# EAGLE design boat6 (EAGLE 7.6.0)
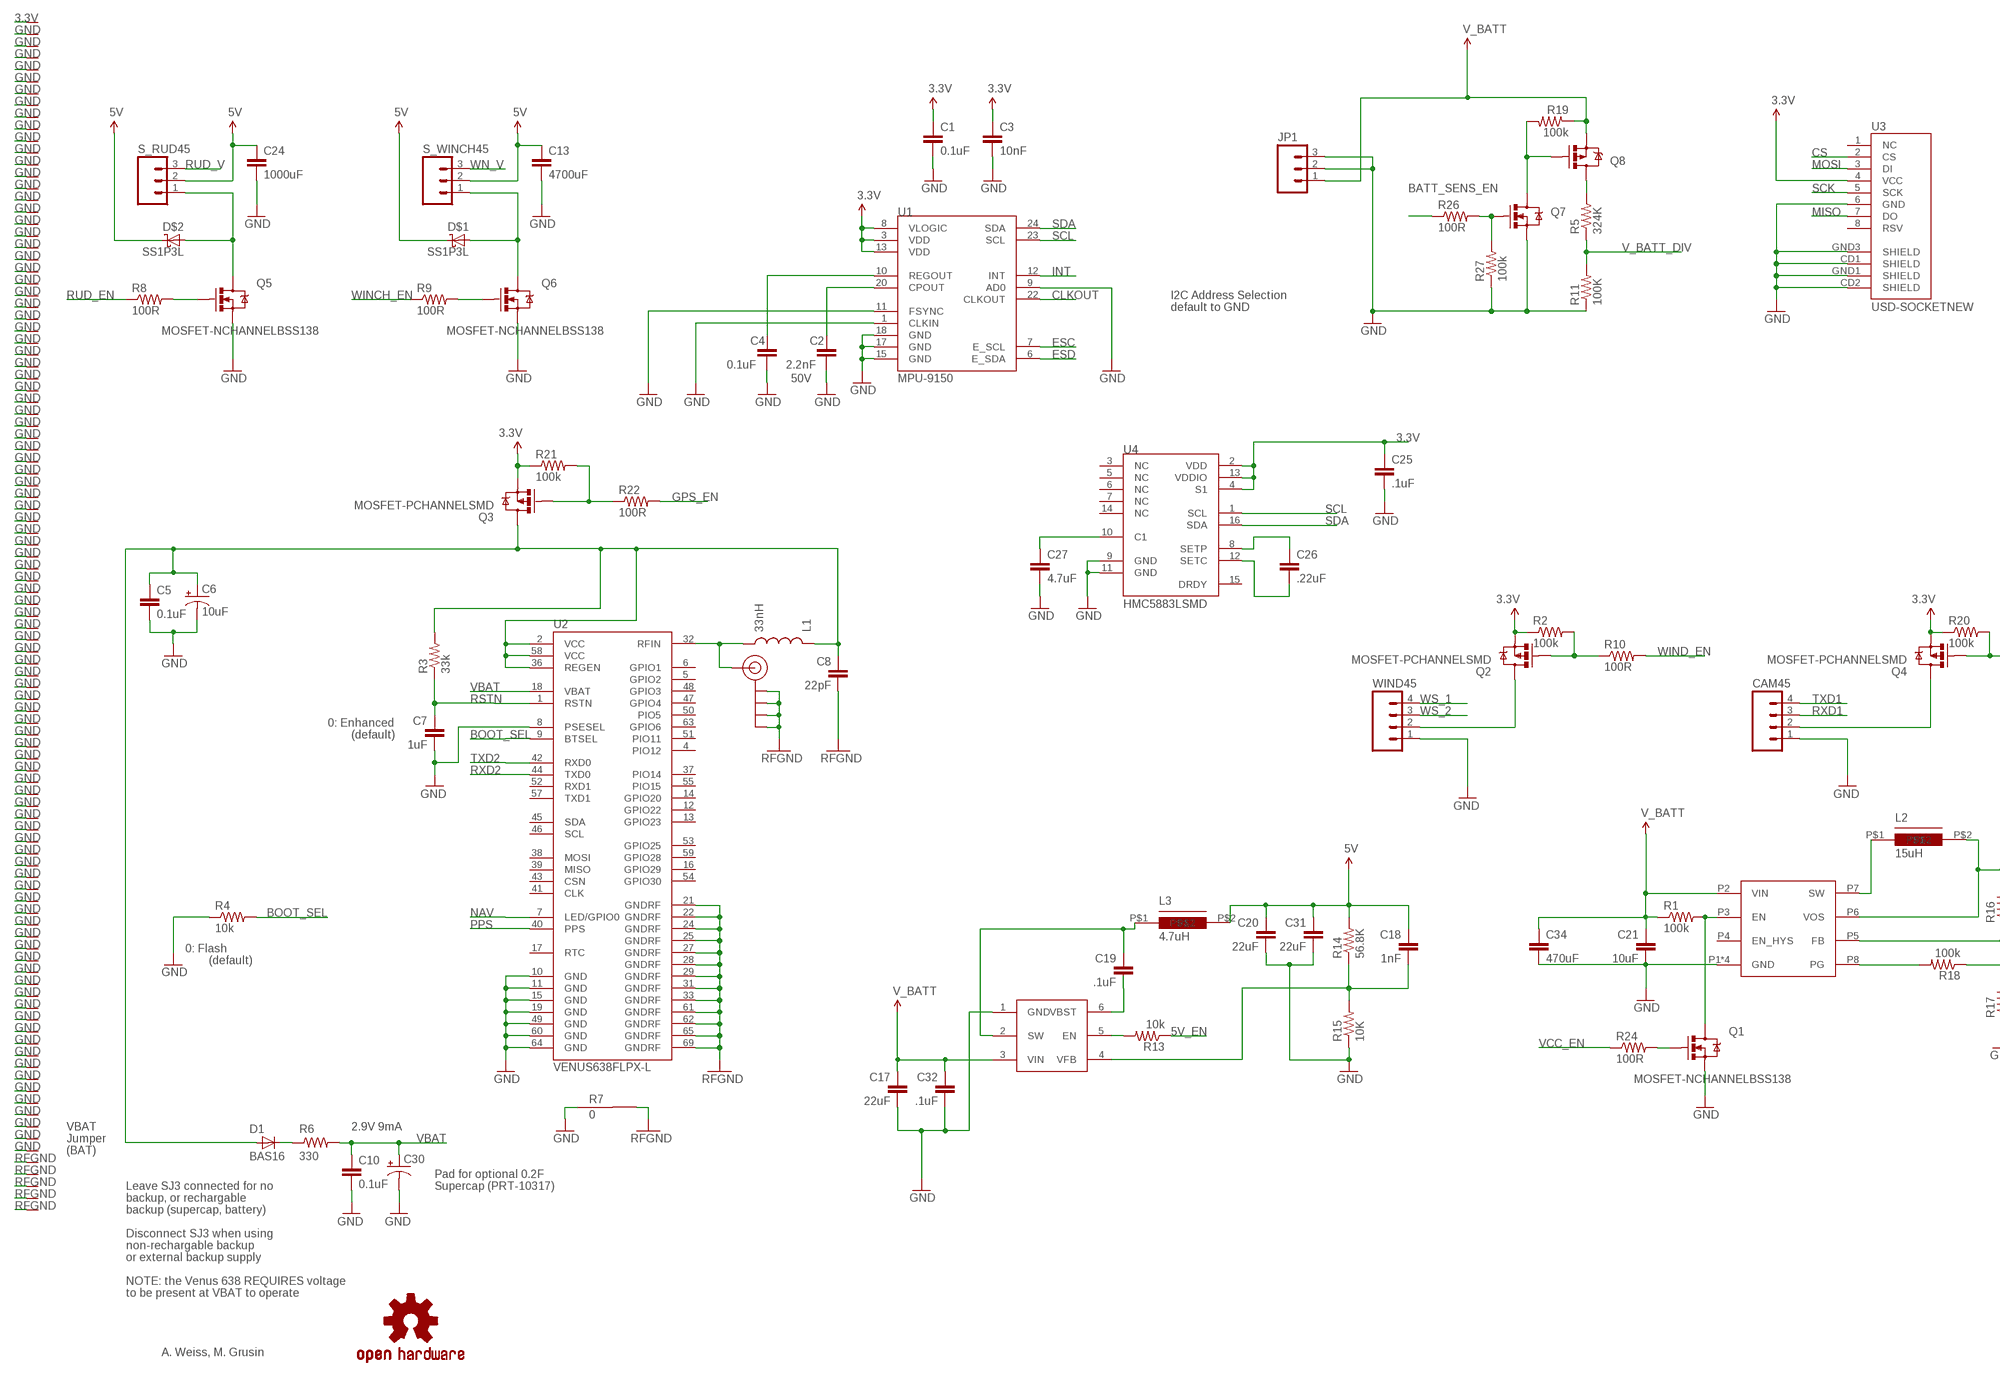
[diagram p0: schematic, sheet 1, part 1 of 2]
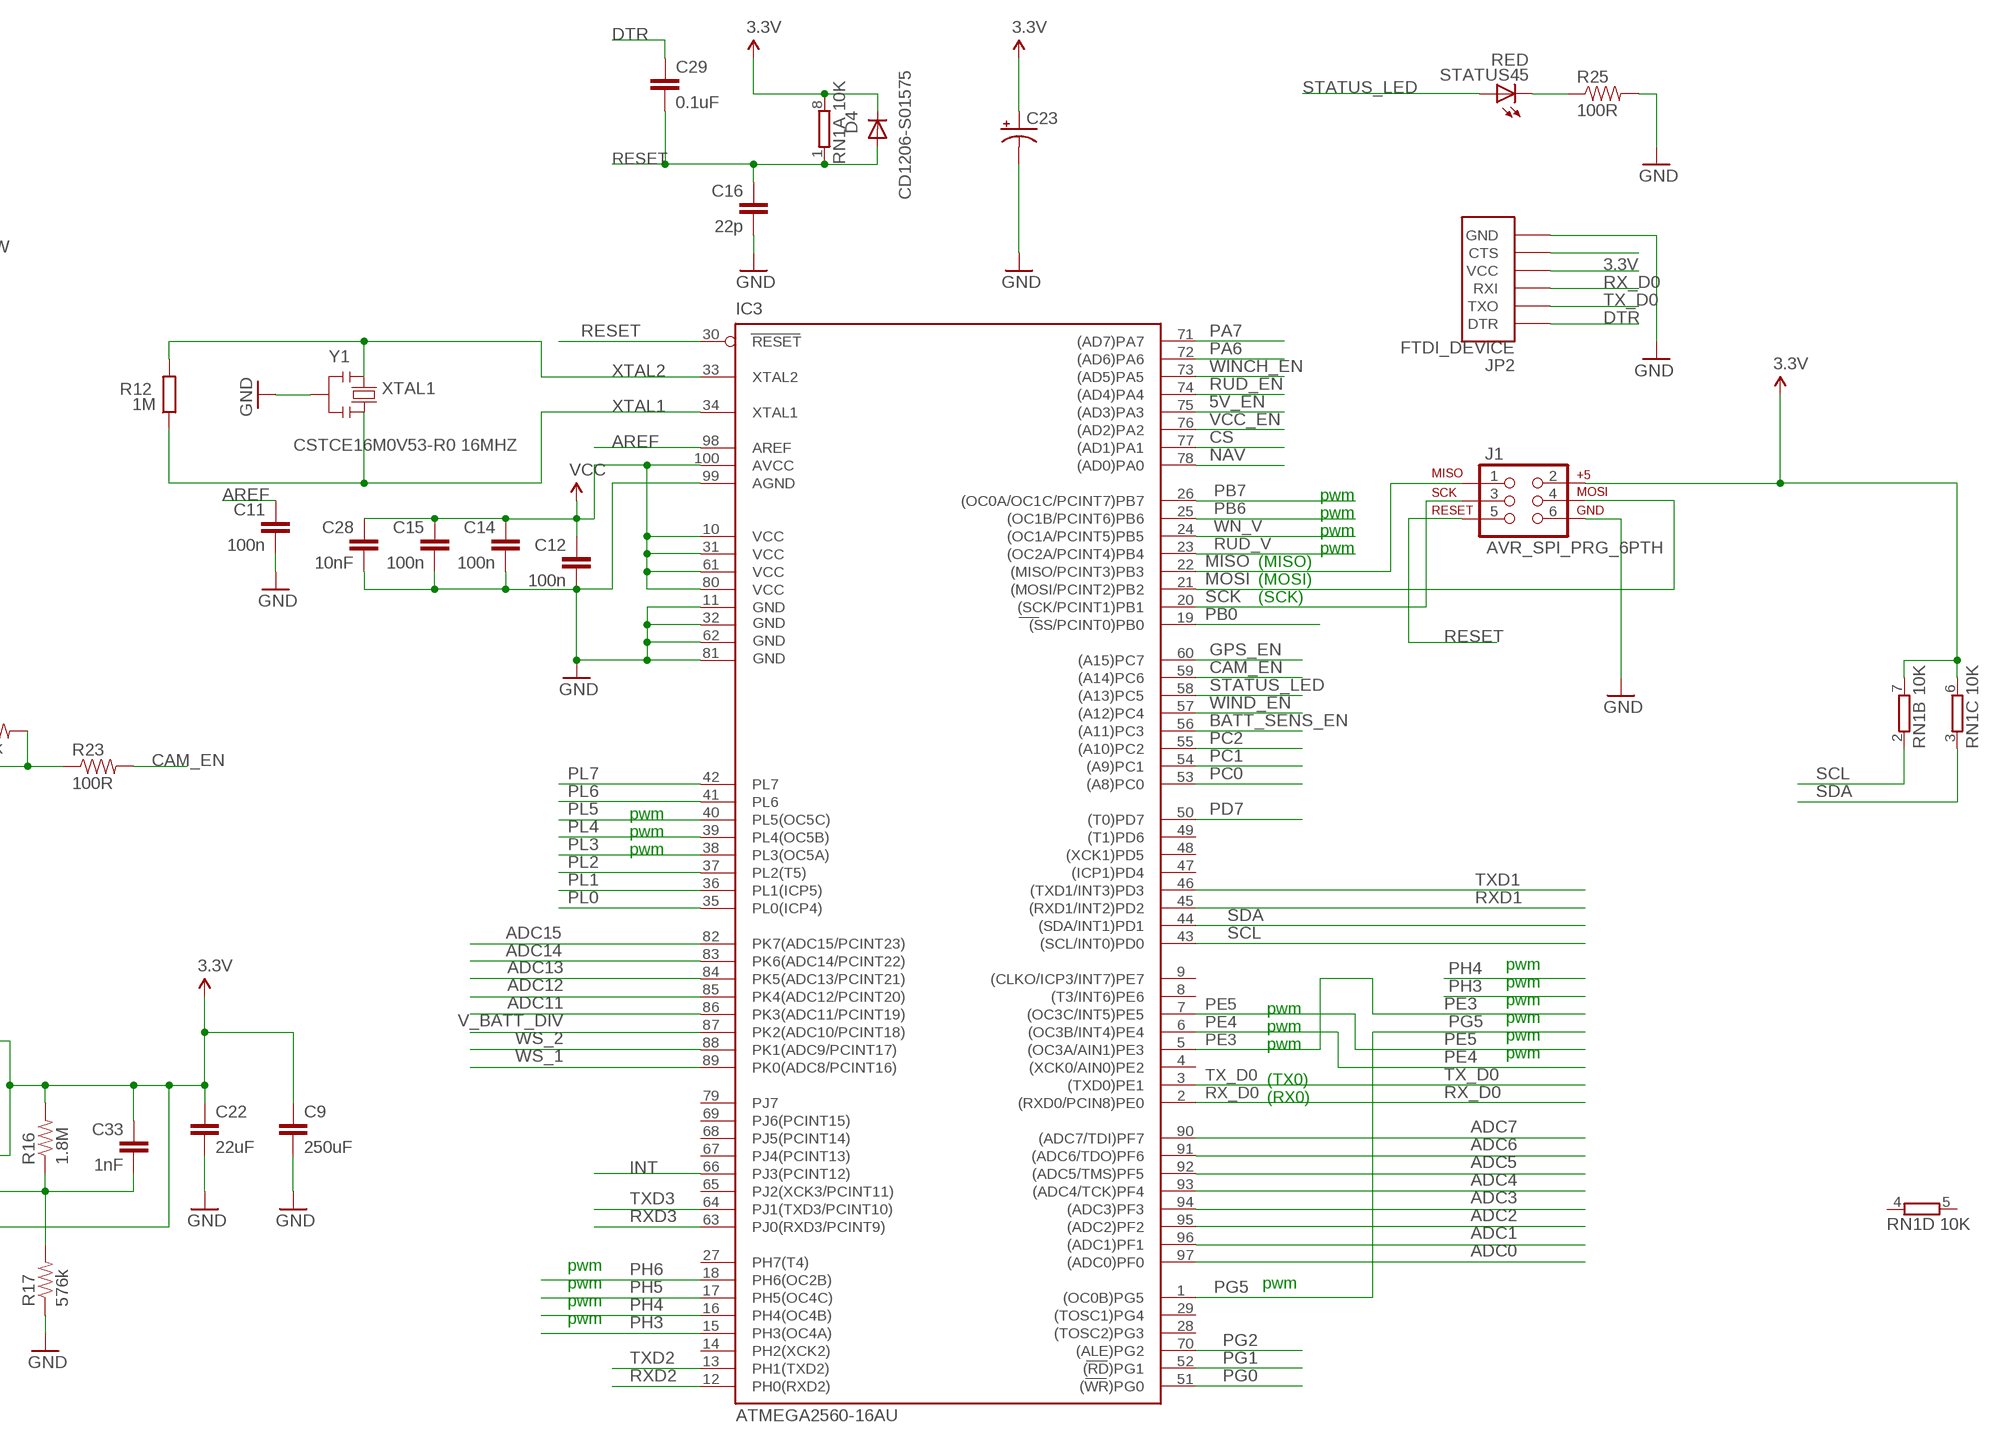
[diagram p1: schematic, sheet 1, part 2 of 2]

## Parts
C1  0.1uF  CAP0603-CAP  [0603-CAP]
C2  2.2nF  CAP0603-CAP  [0603-CAP]
C3  10nF  CAP0603-CAP  [0603-CAP]
C4  0.1uF  CAP0603-CAP  [0603-CAP]
C5  0.1uF  CAP0603-CAP  [0603-CAP]
C6  10uF  CAP_POL1206  [EIA3216]
C7  1uF  CAP0603-CAP  [0603-CAP]
C8  22pF  CAP0603-CAP  [0603-CAP]
C9  250uF  CAPPTH1  [CAP-PTH-5MM]
C10  0.1uF  CAP0603-CAP  [0603-CAP]
C11  100n  C-EU0603-RND  [C0603-ROUND]
C12  100n  C-EU0603-RND  [C0603-ROUND]
C13  4700uF  CAPPTH1  [CAP-PTH-5MM]
C14  100n  C-EU0603-RND  [C0603-ROUND]
C15  100n  C-EU0603-RND  [C0603-ROUND]
C16  22p  C-EU0603-RND  [C0603-ROUND]
C17  22uF  CAP1206  [1206]
C18  1nF  CAP0805  [0805]
C19  .1uF  CAP0805  [0805]
C20  22uF  CAP1206  [1206]
C21  10uF  CAP0805  [0805]
C22  22uF  CAP0805  [0805]
C23  CAP_POL  [DSK-621]
C24  1000uF  CAPPTH1  [CAP-PTH-5MM]
C25  .1uF  CAP0603-CAP  [0603-CAP]
C26  .22uF  CAP0603-CAP  [0603-CAP]
C27  4.7uF  CAP0603-CAP  [0603-CAP]
C28  10nF  CAP0603-CAP  [0603-CAP]
C29  0.1uF  CAP0402-CAP  [0402-CAP]
C30  CAP_POL  [DSK-621]
C31  22uF  CAP1206  [1206]
C32  .1uF  CAP0805  [0805]
C33  1nF  CAP0402-CAP  [0402-CAP]
C34  470uF  CAPPTH1  [CAP-PTH-5MM]
CAM45  M04PTH  [1X04]
D1  BAS16  DIODESOD  [SOD-323]
D4  CD1206-S01575  DIODE-MINIMELF  [MINIMELF]
D$1  SS1P3L  [MICROSMP]
D$2  SS1P3L  [MICROSMP]
IC3  ATMEGA2560-16AU  ATMEGA25602560-16AU  [TQFP100]
J1  AVR_SPI_PRG_6PTH  [2X3]
JP1  M03SCREW  [SCREWTERMINAL-3.5MM-3]
JP2  FTDI_DEVICE  [FTDI_DEVICE_SIDE]
JP5  SMA_EDGE  [SMA-EDGE]
L1  33nH  INDUCTOR0603  [0603]
L2  15uH  VLCF4020  [VLCF4020]
L3  4.7uH  SLF60287055  [SLF7055]
Q1  MOSFET-NCHANNELBSS138  [SOT23]
Q2  MOSFET-PCHANNELSMD  [SOT23-3]
Q3  MOSFET-PCHANNELSMD  [SOT23-3]
Q4  MOSFET-PCHANNELSMD  [SOT23-3]
Q5  MOSFET-NCHANNELBSS138  [SOT23]
Q6  MOSFET-NCHANNELBSS138  [SOT23]
Q7  MOSFET-NCHANNELBSS138  [SOT23]
Q8  MOSFET-PCHANNELSMD  [SOT23-3]
R1  100k  RESISTOR0603  [0603-RES]
R2  100k  RESISTOR0603  [0603-RES]
R3  33k  RESISTOR0603-RES  [0603-RES]
R4  10k  RESISTOR0603-RES  [0603-RES]
R5  324K  RESISTOR0603-RES  [0603-RES]
R6  330  RESISTOR0603-RES  [0603-RES]
R7  0  GND-JUMP  [GND-JUMP]
R8  100R  RESISTOR0603  [0603-RES]
R9  100R  RESISTOR0603  [0603-RES]
R10  100R  RESISTOR0603  [0603-RES]
R11  100K  RESISTOR0603-RES  [0603-RES]
R12  1M  R-EU_R0603  [R0603-ROUND]
R13  10k  RESISTOR0603  [0603-RES]
R14  56.8K  RESISTOR0603  [0603-RES]
R15  10K  RESISTOR0603  [0603-RES]
R16  1.8M  RESISTOR0603  [0603-RES]
R17  576k  RESISTOR0603  [0603-RES]
R18  100k  RESISTOR0603  [0603-RES]
R19  100k  RESISTOR0603  [0603-RES]
R20  100k  RESISTOR0603  [0603-RES]
R21  100k  RESISTOR0603  [0603-RES]
R22  100R  RESISTOR0603  [0603-RES]
R23  100R  RESISTOR0603  [0603-RES]
R24  100R  RESISTOR0603  [0603-RES]
R25  100R  RESISTOR0603  [0603-RES]
R26  100R  RESISTOR0603  [0603-RES]
R27  100k  RESISTOR0603  [0603-RES]
RN1  10K  4R-NCAT16  [CAT16]
S_RUD45  M03PTH  [1X03]
S_WINCH45  M03PTH  [1X03]
STATUS45  RED  LED-RED0603  [LED-0603]
U1  MPU-9150  MPU-9150QFN-24-NP  [QFN-24-NP]
U2  VENUS638FLPX-L  [VENUS638FLPX]
U3  USD-SOCKETNEW  [MICRO-SD-SOCKET-PP]
U4  HMC5883LSMD  [16LPCC]
U$1  TPS62125  [S-PWSON-N8]
U$2  TPS56X200  [SOT23-6]
U$4  OSHW-LOGOS  [OSHW-LOGO-S]
VP_0  VPDEV0  [VPAC0]
VP_1  VPDEV1  [VPAC1]
VP_2  VPDEV1  [VPAC1]
VP_3  VPDEV1  [VPAC1]
VP_4  VPDEV0  [VPAC0]
VP_5  VPDEV2  [VPAC2]
VP_6  VPDEV2  [VPAC2]
VP_7  VPDEV2  [VPAC2]
VP_8  VPDEV2  [VPAC2]
VP_9  VPDEV2  [VPAC2]
VP_10  VPDEV2  [VPAC2]
VP_11  VPDEV0  [VPAC0]
VP_12  VPDEV2  [VPAC2]
VP_13  VPDEV2  [VPAC2]
VP_14  VPDEV2  [VPAC2]
VP_15  VPDEV2  [VPAC2]
VP_16  VPDEV0  [VPAC0]
VP_17  VPDEV2  [VPAC2]
VP_18  VPDEV2  [VPAC2]
VP_19  VPDEV2  [VPAC2]
VP_20  VPDEV2  [VPAC2]
VP_21  VPDEV2  [VPAC2]
VP_22  VPDEV2  [VPAC2]
VP_23  VPDEV0  [VPAC0]
VP_24  VPDEV0  [VPAC0]
VP_25  VPDEV0  [VPAC0]
VP_26  VPDEV0  [VPAC0]
VP_27  VPDEV2  [VPAC2]
VP_28  VPDEV0  [VPAC0]
VP_29  VPDEV0  [VPAC0]
VP_30  VPDEV2  [VPAC2]
VP_31  VPDEV2  [VPAC2]
VP_32  VPDEV0  [VPAC0]
VP_33  VPDEV2  [VPAC2]
VP_34  VPDEV2  [VPAC2]
VP_35  VPDEV2  [VPAC2]
VP_36  VPDEV2  [VPAC2]
VP_37  VPDEV2  [VPAC2]
VP_38  VPDEV0  [VPAC0]
VP_39  VPDEV0  [VPAC0]
VP_40  VPDEV0  [VPAC0]
VP_41  VPDEV0  [VPAC0]
VP_42  VPDEV0  [VPAC0]
VP_43  VPDEV0  [VPAC0]
VP_44  VPDEV0  [VPAC0]
VP_45  VPDEV0  [VPAC0]
VP_46  VPDEV2  [VPAC2]
VP_47  VPDEV2  [VPAC2]
VP_48  VPDEV2  [VPAC2]
VP_49  VPDEV2  [VPAC2]
VP_50  VPDEV2  [VPAC2]
VP_51  VPDEV2  [VPAC2]
VP_52  VPDEV2  [VPAC2]
VP_53  VPDEV2  [VPAC2]
VP_54  VPDEV2  [VPAC2]
VP_55  VPDEV2  [VPAC2]
VP_56  VPDEV2  [VPAC2]
VP_57  VPDEV2  [VPAC2]
VP_58  VPDEV2  [VPAC2]
VP_59  VPDEV2  [VPAC2]
VP_60  VPDEV0  [VPAC0]
VP_61  VPDEV0  [VPAC0]
VP_62  VPDEV0  [VPAC0]
VP_63  VPDEV2  [VPAC2]
VP_64  VPDEV2  [VPAC2]
VP_65  VPDEV2  [VPAC2]
VP_66  VPDEV2  [VPAC2]
VP_67  VPDEV2  [VPAC2]
VP_68  VPDEV2  [VPAC2]
VP_69  VPDEV2  [VPAC2]
VP_70  VPDEV0  [VPAC0]
VP_71  VPDEV0  [VPAC0]
VP_72  VPDEV0  [VPAC0]
VP_73  VPDEV0  [VPAC0]
VP_74  VPDEV0  [VPAC0]
VP_75  VPDEV0  [VPAC0]
VP_76  VPDEV2  [VPAC2]
VP_77  VPDEV2  [VPAC2]
VP_78  VPDEV2  [VPAC2]
VP_79  VPDEV0  [VPAC0]
VP_80  VPDEV0  [VPAC0]
VP_81  VPDEV2  [VPAC2]
VP_82  VPDEV2  [VPAC2]
VP_83  VPDEV2  [VPAC2]
VP_84  VPDEV2  [VPAC2]
VP_85  VPDEV2  [VPAC2]
VP_86  VPDEV2  [VPAC2]
VP_87  VPDEV2  [VPAC2]
VP_88  VPDEV2  [VPAC2]
VP_89  VPDEV2  [VPAC2]
VP_90  VPDEV2  [VPAC2]
VP_91  VPDEV2  [VPAC2]
VP_92  VPDEV2  [VPAC2]
VP_93  VPDEV2  [VPAC2]
VP_94  VPDEV2  [VPAC2]
VP_95  VPDEV2  [VPAC2]
VP_96  VPDEV1  [VPAC1]
VP_97  VPDEV1  [VPAC1]
VP_98  VPDEV1  [VPAC1]
VP_99  VPDEV1  [VPAC1]
VP_100  VPDEV1  [VPAC1]
WIND45  M04PTH  [1X04]
Y1  CSTCE16M0V53-R0 16MHZ  RESONATORMU  [RESONATOR]

## Nets
3.3V: C1.1 C3.1 C9.1 C12.1 C14.1 C15.1 C22.1 C23.VCC(+) C25.1 C28.1 C33.1 D4.C IC3.10(VCC) IC3.31(VCC1) IC3.61(VCC2) IC3.80(VCC3) IC3.100(AVCC) J1.2 JP2.P$4(VCC) L2.P$2 Q2.2(S) Q3.2(S) Q4.2(S) R2.1 R16.2 R18.1 R20.1 R21.1 RN1.6 RN1.7 RN1.8 U1.3(VDD) U1.8(VLOGIC) U1.13(VDD) U3.4(VCC) U4.2(VDD) U4.4(S1) U4.13(VDDIO) U$1.P6(VOS) VP_0.VP ; supply symbol labelled VCC
5V: C13.1 C18.1 C20.1 C24.1 C31.1 D$1.C D$2.C L3.P$2 R14.2 S_RUD45.2 S_WINCH45.2
5V_EN: IC3.75((AD3)PA3) R13.1
ADC0: IC3.97((ADC0)PF0)
ADC1: IC3.96((ADC1)PF1)
ADC2: IC3.95((ADC2)PF2)
ADC3: IC3.94((ADC3)PF3)
ADC4: IC3.93((ADC4/TCK)PF4)
ADC5: IC3.92((ADC5/TMS)PF5)
ADC6: IC3.91((ADC6/TDO)PF6)
ADC7: IC3.90((ADC7/TDI)PF7)
ADC11: IC3.86(PK3(ADC11/PCINT19))
ADC12: IC3.85(PK4(ADC12/PCINT20))
ADC13: IC3.84(PK5(ADC13/PCINT21))
ADC14: IC3.83(PK6(ADC14/PCINT22))
ADC15: IC3.82(PK7(ADC15/PCINT23))
ANT: JP5.SIG(SIGNAL) L1.2 U2.32(RFIN)
AREF: C11.1 IC3.98(AREF)
BATT_SENS_EN: IC3.56((A11)PC3) R26.1
BOOT_SEL: R4.2 U2.9(BTSEL)
CAM_EN: IC3.59((A14)PC6) R23.2
CLKOUT: U1.22(CLKOUT)
CS: IC3.77((AD1)PA1) U3.2(CS)
DTR: C29.1 JP2.P$1(DTR)
ESC: U1.7(E_SCL)
ESD: U1.6(E_SDA)
GND: C1.2 C2.2 C3.2 C4.2 C5.2 C6.C(-) C7.2 C9.2 C10.2 C11.2 C12.2 C13.2 C14.2 C15.2 C16.2 C17.2 C20.2 C21.2 C22.2 C23.GND(-) C24.2 C25.2 C27.2 C28.2 C30.GND(-) C31.2 C32.2 C34.2 CAM45.1 IC3.11(GND) IC3.32(GND1) IC3.62(GND2) IC3.81(GND3) IC3.99(AGND) J1.6 JP1.2 JP1.3 JP2.P$6(GND) Q1.2(S) Q5.2(S) Q6.2(S) Q7.2(S) R4.1 R7.1 R11.1 R15.1 R17.1 R25.2 R27.1 U1.1(CLKIN) U1.9(AD0) U1.11(FSYNC) U1.15(GND) U1.17(GND) U1.18(GND) U2.8(PSESEL) U2.10(GND) U2.11(GND) U2.15(GND) U2.19(GND) U2.49(GND) U2.60(GND) U2.64(GND) U3.6(GND) U3.CD1(SHIELD) U3.CD2(SHIELD) U3.GND1(SHIELD) U3.GND3(SHIELD) U4.9(GND) U4.11(GND) U$1.P1(GND) U$1.P_THERM(GND) U$1.P_THERM_VIA1(GND) U$1.P_THERM_VIA(GND) U$2.1(GND) VP_1.VP VP_2.VP VP_3.VP VP_4.VP VP_5.VP VP_6.VP VP_7.VP VP_8.VP VP_9.VP VP_10.VP VP_11.VP VP_12.VP VP_13.VP VP_14.VP VP_15.VP VP_16.VP VP_17.VP VP_18.VP VP_19.VP VP_20.VP VP_21.VP VP_22.VP VP_23.VP VP_24.VP VP_25.VP VP_26.VP VP_27.VP VP_28.VP VP_29.VP VP_30.VP VP_31.VP VP_32.VP VP_33.VP VP_34.VP VP_35.VP VP_36.VP VP_37.VP VP_38.VP VP_39.VP VP_40.VP VP_41.VP VP_42.VP VP_43.VP VP_44.VP VP_45.VP VP_46.VP VP_47.VP VP_48.VP VP_49.VP VP_50.VP VP_51.VP VP_52.VP VP_53.VP VP_54.VP VP_55.VP VP_56.VP VP_57.VP VP_58.VP VP_59.VP VP_60.VP VP_61.VP VP_62.VP VP_63.VP VP_64.VP VP_65.VP VP_66.VP VP_67.VP VP_68.VP VP_69.VP VP_70.VP VP_71.VP VP_72.VP VP_73.VP VP_74.VP VP_75.VP VP_76.VP VP_77.VP VP_78.VP VP_79.VP VP_80.VP VP_81.VP VP_82.VP VP_83.VP VP_84.VP VP_85.VP VP_86.VP VP_87.VP VP_88.VP VP_89.VP VP_90.VP VP_91.VP VP_92.VP VP_93.VP VP_94.VP VP_95.VP WIND45.1 Y1.2
GPS_EN: IC3.60((A15)PC7) R22.2
GPS_PWR: C5.1 C6.A(+) C8.1 D1.2(A) L1.1 Q3.3(D) R3.2 U2.2(VCC) U2.36(REGEN) U2.58(VCC)
INT: IC3.66(PJ3(PCINT12)) U1.12(INT)
MISO: IC3.22((MISO/PCINT3)PB3) J1.1 U3.7(DO)
MOSI: IC3.21((MOSI/PCINT2)PB2) J1.4 U3.3(DI)
N$1: C2.1 U1.20(CPOUT)
N$2: C4.1 U1.10(REGOUT)
N$3: C26.1 U4.8(SETP)
N$5: D1.1(C) R6.1
N$7: Q5.1(G) R8.2
N$8: D$1.A Q6.3(D) S_WINCH45.1
N$9: D$2.A Q5.3(D) S_RUD45.1
N$10: Q6.1(G) R9.2
N$11: C19.1 L3.P$1 U$2.2(SW)
N$13: C26.2 U4.12(SETC)
N$14: L2.P$1 U$1.P7(SW)
N$15: R13.2 U$2.5(EN)
N$16: C27.1 U4.10(C1)
N$17: C33.2 R16.1 R17.2 U$1.P5(FB)
N$18: R18.2 U$1.P8(PG)
N$19: C18.2 R14.1 R15.2 U$2.4(VFB)
N$20: CAM45.2 Q4.3(D)
N$21: Q4.1(G) R20.2 R23.1
N$22: Q3.1(G) R21.2 R22.1
N$23: Q1.3(D) R1.2 U$1.P3(EN)
N$24: Q1.1(G) R24.2
N$25: JP2.P$5(CTS)
N$26: Q2.3(D) WIND45.2
N$27: R25.1 STATUS45.C
N$28: Q2.1(G) R2.2 R10.1
N$29: Q8.3(D) R5.2
N$30: Q7.3(D) Q8.1(G) R19.2
N$31: Q7.1(G) R26.2 R27.2
N$32: C19.2 U$2.6(VBST)
NAV: IC3.78((AD0)PA0) U2.7(LED/GPIO0)
PA6: IC3.72((AD6)PA6)
PA7: IC3.71((AD7)PA7)
PB0: IC3.19((SS/PCINT0)PB0)
PB6: IC3.25((OC1B/PCINT6)PB6)
PB7: IC3.26((OC0A/OC1C/PCINT7)PB7)
PC0: IC3.53((A8)PC0)
PC1: IC3.54((A9)PC1)
PC2: IC3.55((A10)PC2)
PD7: IC3.50((T0)PD7)
PE3: IC3.5((OC3A/AIN1)PE3)
PE4: IC3.6((OC3B/INT4)PE4)
PE5: IC3.7((OC3C/INT5)PE5)
PG0: IC3.51((WR)PG0)
PG1: IC3.52((RD)PG1)
PG2: IC3.70((ALE)PG2)
PG5: IC3.1((OC0B)PG5)
PH3: IC3.15(PH3(OC4A))
PH4: IC3.16(PH4(OC4B))
PH5: IC3.17(PH5(OC4C))
PH6: IC3.18(PH6(OC2B))
PL0: IC3.35(PL0(ICP4))
PL1: IC3.36(PL1(ICP5))
PL2: IC3.37(PL2(T5))
PL3: IC3.38(PL3(OC5A))
PL4: IC3.39(PL4(OC5B))
PL5: IC3.40(PL5(OC5C))
PL6: IC3.41(PL6)
PL7: IC3.42(PL7)
PPS: U2.40(PPS)
RESET: C16.1 C29.2 D4.A IC3.30(RESET) J1.5 RN1.1
RFGND: C8.2 JP5.GND@0(GND) JP5.GND@1(GND) JP5.GND@2(GND) JP5.GND@3(GND) R7.2 U2.21(GNDRF) U2.22(GNDRF) U2.24(GNDRF) U2.25(GNDRF) U2.27(GNDRF) U2.28(GNDRF) U2.29(GNDRF) U2.31(GNDRF) U2.33(GNDRF) U2.61(GNDRF) U2.62(GNDRF) U2.65(GNDRF) U2.69(GNDRF) VP_96.VP VP_97.VP VP_98.VP VP_99.VP VP_100.VP
RSTN: C7.1 R3.1 U2.1(RSTN)
RUD_EN: IC3.74((AD4)PA4) R8.1
RUD_V: IC3.23((OC2A/PCINT4)PB4) S_RUD45.3
RX_D0: IC3.2((RXD0/PCIN8)PE0) JP2.P$3(RXI)
RXD1: CAM45.3 IC3.45((RXD1/INT2)PD2)
RXD2: IC3.12(PH0(RXD2)) U2.44(TXD0)
RXD3: IC3.63(PJ0(RXD3/PCINT9))
SCK: IC3.20((SCK/PCINT1)PB1) J1.3 U3.5(SCK)
SCL: IC3.43((SCL/INT0)PD0) RN1.2 U1.23(SCL) U4.1(SCL)
SDA: IC3.44((SDA/INT1)PD1) RN1.3 U1.24(SDA) U4.16(SDA)
STATUS_LED: IC3.58((A13)PC5) STATUS45.A
TX_D0: IC3.3((TXD0)PE1) JP2.P$2(TXO)
TXD1: CAM45.4 IC3.46((TXD1/INT3)PD3)
TXD2: IC3.13(PH1(TXD2)) U2.42(RXD0)
TXD3: IC3.64(PJ1(TXD3/PCINT10))
V_BATT: C17.1 C21.1 C32.1 C34.1 JP1.1 Q8.2(S) R1.1 R19.1 U$1.P2(VIN) U$2.3(VIN)
V_BATT_DIV: IC3.87(PK2(ADC10/PCINT18)) R5.1 R11.2
VBAT: C10.1 C30.VCC(+) R6.2 U2.18(VBAT)
VCC_EN: IC3.76((AD2)PA2) R24.1
WINCH_EN: IC3.73((AD5)PA5) R9.1
WIND_EN: IC3.57((A12)PC4) R10.2
WN_V: IC3.24((OC1A/PCINT5)PB5) S_WINCH45.3
WS_1: IC3.89(PK0(ADC8/PCINT16)) WIND45.4
WS_2: IC3.88(PK1(ADC9/PCINT17)) WIND45.3
XTAL1: IC3.34(XTAL1) R12.1 Y1.3
XTAL2: IC3.33(XTAL2) R12.2 Y1.1
Unconnected: IC3.4((XCK0/AIN0)PE2) IC3.8((T3/INT6)PE6) IC3.9((CLKO/ICP3/INT7)PE7) IC3.14(PH2(XCK2)) IC3.27(PH7(T4)) IC3.28((TOSC2)PG3) IC3.29((TOSC1)PG4) IC3.47((ICP1)PD4) IC3.48((XCK1)PD5) IC3.49((T1)PD6) IC3.65(PJ2(XCK3/PCINT11)) IC3.67(PJ4(PCINT13)) IC3.68(PJ5(PCINT14)) IC3.69(PJ6(PCINT15)) IC3.79(PJ7) RN1.4 RN1.5 U2.4(PIO12) U2.5(GPIO2) U2.6(GPIO1) U2.12(GPIO22) U2.13(GPIO23) U2.14(GPIO20) U2.16(GPIO29) U2.17(RTC) U2.37(PIO14) U2.38(MOSI) U2.39(MISO) U2.41(CLK) U2.43(CSN) U2.45(SDA) U2.46(SCL) U2.47(GPIO4) U2.48(GPIO3) U2.50(PIO5) U2.51(PIO11) U2.52(RXD1) U2.53(GPIO25) U2.54(GPIO30) U2.55(PIO15) U2.57(TXD1) U2.59(GPIO28) U2.63(GPIO6) U3.1(NC) U3.8(RSV) U4.3(NC) U4.5(NC) U4.6(NC) U4.7(NC) U4.14(NC) U4.15(DRDY) U$1.P4(EN_HYS)

## Notes on the sheet
- I2C Address Selection
- default to GND
- 50V
- pwm
- pwm
- pwm
- pwm
- (MISO)
- (MOSI)
- (SCK)
- pwm
- pwm
- pwm
- 0: Enhanced
- (default)
- RFGND | RFGND
- pwm
- pwm
- pwm
- pwm
- pwm
- pwm
- pwm
- pwm
- pwm
- (TX0)
- (RX0)
- 0: Flash
- (default)
- pwm
- pwm | pwm
- pwm
- pwm
- RFGND
- VBAT | 2.9V 9mA
- Jumper | RFGND
- (BAT)
- Pad for optional 0.2F
- Leave SJ3 connected for no | Supercap (PRT-10317)
- backup, or rechargable
- backup (supercap, battery)
- Disconnect SJ3 when using
- non-rechargable backup
- or external backup supply
- NOTE: the Venus 638 REQUIRES voltage
- to be present at VBAT to operate
- A. Weiss, M. Grusin

## Library data of the parts
C1-C4 C28 C29 C33 = SparkFun-Passives:CAP: Capacitor Standard 0603 ceramic capacitor, and 0.1" leaded capacitor.
C5 C7 C8 C10 C25-C27 = SparkFun:CAP: Capacitor Standard 0603 ceramic capacitor, and 0.1" leaded capacitor.
C6 = SparkFun:CAP_POL: Capacitor Polarized These are standard SMD and PTH capacitors. Normally 10uF, 47uF, and 100uF in electrolytic and tantalum varieties. Always verify the external diameter of the through hole cap, it varies with capacity, voltage, and manufacturer. The EIA devices should be standard.
C9 C13 C17-C22 C24 C31 C32 C34 = SparkFun-Capacitors:CAP: Capacitor Standard 0603 ceramic capacitor, and 0.1" leaded capacitor.
C11 C12 C14-C16 = SmartPrj:C-EU: CAPACITOR, European symbol
C23 C30 = kolosy:CAP_POL: Capacitor Polarized These are standard SMD and PTH capacitors. Normally 10uF, 47uF, and 100uF in electrolytic and tantalum varieties. Always verify the external diameter of the through hole cap, it varies with capacity, voltage, and manufacturer. The EIA devices should be standard.
CAM45 WIND45 = SparkFun-Connectors:M04: Header 4 Standard 4-pin 0.1" header. Use with straight break away headers (SKU : PRT-00116), right angle break away headers (PRT-00553), swiss pins (PRT-00743), machine pins (PRT-00117), and female headers (PRT-00115). Molex polarized connector foot print use with SKU : PRT-08231 with associated crimp pins and housings. 1MM SMD Version SKU: PRT-10208
D1 = SparkFun:DIODE: Diode These are standard reverse protection diodes and small signal diodes. SMA package can handle up to about 1A. SOD-323 can handle about 200mA. What the SOD-323 package when ordering, there are some mfgs out there that are 5-pin packages.
D4 = diode:DIODE-: DIODE
D$1 D$2 = kolosy:SS1P3L: Surface Mount Schottky Barrier Rectifiers (http://www.vishay.com/docs/89020/mss1p3l.pdf)
IC3 = SmartPrj:ATMEGA2560: MICROCONTROLLER 64/128/256 Kbytes FLASH 4 Kbytes EEPROM 8 Kbytes SRAM 86 General Purpose I/O pins 12-channels16-bit PWM 4 x Serial USARTs 16-channels 10-bit A/D
J1 = SparkFun-Connectors:AVR_SPI_PRG_6: AVR ISP 6 Pin This is the reduced ISP connector for AVR programming. Common on Arduino. This footprint will take up less PCB space and can be used with a 10-pin to 6-pin adapter such as SKU: BOB-08508
JP1 S_RUD45 S_WINCH45 = SparkFun-Connectors:M03: Header 3 Standard 3-pin 0.1" header. Use with straight break away headers (SKU : PRT-00116), right angle break away headers (PRT-00553), swiss pins (PRT-00743), machine pins (PRT-00117), and female headers (PRT-00115). Molex polarized connector foot print use with SKU : PRT-08232 with associated crimp pins and housings.
JP2 = SparkFun-Connectors:FTDI_DEVICE: Connector which mates to FTDI basic or FTDI cable.
JP5 = SparkFun:SMA_EDGE: SMA Antenna Connector End launch SMA connector. The paste layer has been removed so that the connector can be hand soldered onto the board after reflow.
L1 = SparkFun:INDUCTOR: Inductors Basic Inductor/Choke - 0603 and 1206. Footprints are not proven and vary greatly between part numbers.
L2 = kolosy:VLCF4020
L3 = kolosy:SLF6028
Q1 Q5-Q7 = SparkFun-DiscreteSemi:MOSFET-NCHANNEL: Common NMOSFET Parts MFG P/N Store ID Prod ID FDD8780 TRANS-09984 SI7820DN TRANS-11055 FDS6630A IC-08089 2N7002PW TRANS-11151 FQP30N06L COM-10213 TRANS-10060 BSS123LT1G TRANS-08345 BSS138 TRANS-00830 BS170 2N7000; PROD_ID: TRANS-00830
Q2-Q4 Q8 = SparkFun-DiscreteSemi:MOSFET-PCHANNEL: Generic PMOSFET
R1 R2 R8-R10 R13-R27 = SparkFun-Resistors:RESISTOR: Resistor Basic schematic elements and footprints for 0603, 1206, and PTH resistors.
R3 R4 R6 = SparkFun:RESISTOR: Resistor Basic schematic elements and footprints for 0603, 1206, and PTH resistors.
R5 R11 = SparkFun-Passives:RESISTOR: Resistor Basic schematic elements and footprints for 0603, 1206, and PTH resistors.
R7 = mike-temp:GND-JUMP: Zero-Ohm trace for connecting different ground planes at a single point.
R12 = SmartPrj:R-EU_: RESISTOR, European symbol
RN1 = resistor-dil:4R-N: Array Chip Resistor Source: RS Component / Phycomp
STATUS45 = SparkFun-LED:LED-RED: Assorted Red LEDs LilyPad 1206- DIO-09912 1206- DIO-00809 0603- DIO-00819; PROD_ID: DIO-00819
U1 = SparkFun-Sensors:MPU-9150: 9DOF (3mag, 3accel, 3rotat). I2C interface.
U2 = mike-temp:VENUS638FLPX-L: Venus638FLPX-L GPS Receiver Venus638FLPx is a high performance, low cost, single chip GPS receiver targeting mobile consumer and cellular handset applications. It offers very low power consumption, high sensitivity, and best in class signal acquisition and time-to-first-fix performance. Venus638FLPx contains all the necessary components of a complete GPS receiver, includes 1.2dB cascaded system NF RF front-end, GPS baseband signal processor, 0.5ppm TCXO, 32.768kHz RTC crystal, RTC LDO regulator, and passive components. It requires very low external component count and takes up only 100mm2 PCB footprint. Dedicated massive-correlator signal parameter search engine within the baseband enables rapid search of all the available satellites and acquisition of very weak signal. An advanced track engine allows weak signal tracking and positioning in harsh environments such as urban canyons and under deep foliage. The self-contained architecture keeps GPS processing off the host and allows integration into applications with very little resource. FEATURES 20Hz update rate -148dBm cold start sensitivity -165dBm tracking sensitivity 29 second cold start TTFF 3.5 second TTFF with AGPS 1 second hot start 2.5m accuracy Multipath detection and suppression Jamming detection and mitigation SBAS (WAAS / EGNOS) support 7-day extended ephemeris AGPS 67mW full power navigation Works directly with active or passive antenna Internal flash for optional 75K point data logging Supports external SPI flash memory data logging Complete receiver in 10mm x 10mm x 1.3mm size Contains LNA, SAW Filter, TCXO, RTC Xtal, LDO Pb-free RoHS compliant
U3 = SparkFun:USD-SOCKET: microSD Socket Push-push type uSD socket. Schematic element and footprint production proven. Spark Fun Electronics SKU : PRT-00127. tDoc lines correctly indicate media card edge positions when inserting (unlocked, locked, depressed).
U4 = SparkFun:HMC5883L: 3 Axis Digital Compass IC
U$1 = kolosy:TPS62125
U$2 = kolosy:TPS56X200
U$4 = SparkFun:OSHW-LOGO: Open Source Hardware Logo This logo indicates the piece of hardware it is found on incorporates a OSHW license and/or adheres to the definition of open source hardware found here: http://freedomdefined.org/OSHW
VP_0 VP_4 VP_11 VP_16 VP_23-VP_26 VP_28 VP_29 VP_32 VP_38-VP_45 VP_60-VP_62 VP_70-VP_75 VP_79 VP_80 = vpad:VPDEV0: VIAPAD
VP_1-VP_3 VP_96-VP_100 = vpad:VPDEV1: VIAPAD
VP_5-VP_10 VP_12-VP_15 VP_17-VP_22 VP_27 VP_30 VP_31 VP_33-VP_37 VP_46-VP_59 VP_63-VP_69 VP_76-VP_78 VP_81-VP_95 = vpad:VPDEV2: VIAPAD
Y1 = SmartPrj:RESONATOR

## Net classes
0 default: width 0.203 mm, drill 0.406 mm, clearance 0.203 mm
2 gnd: width 0.305 mm, drill 0.406 mm, clearance 0.203 mm
3 power usb: width 0.508 mm, drill 0.406 mm, clearance 0.203 mm

## Board
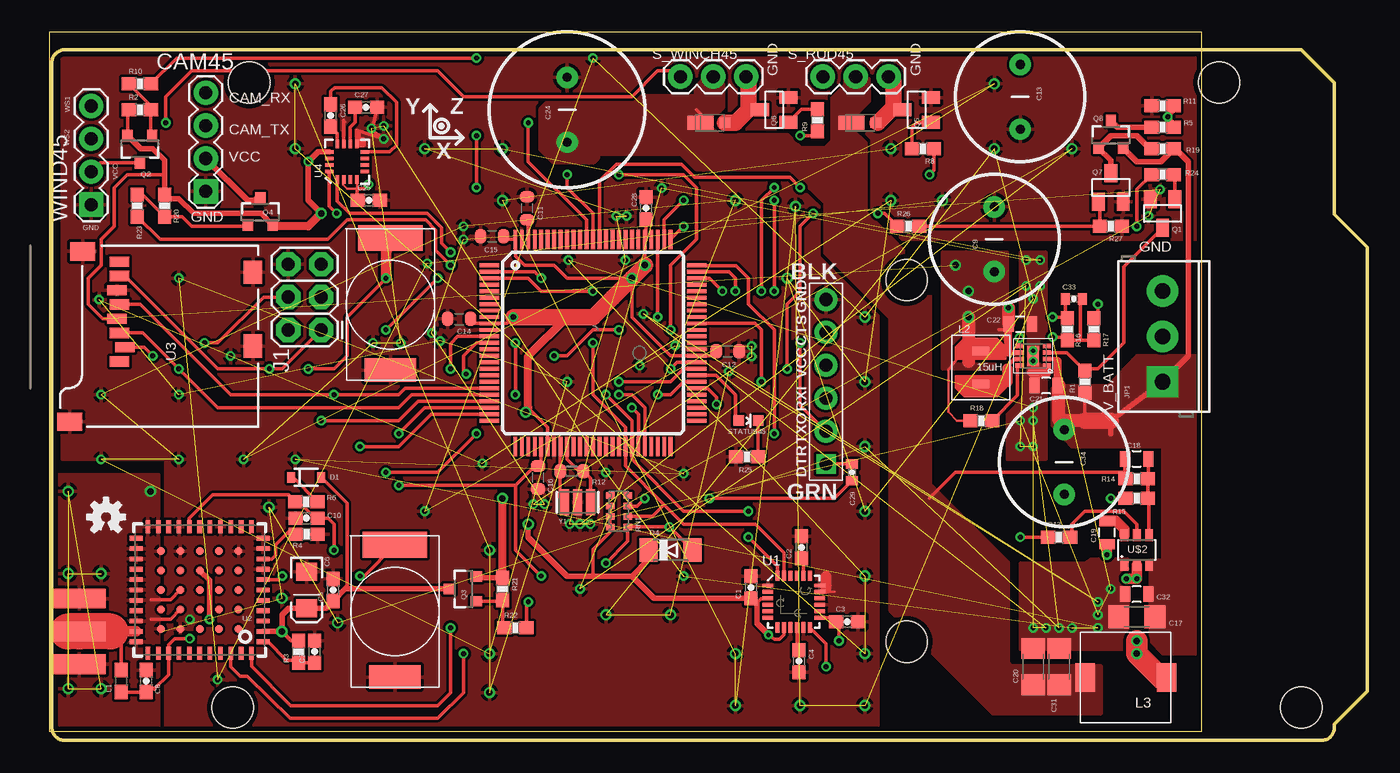
[diagram p2: board, top side]
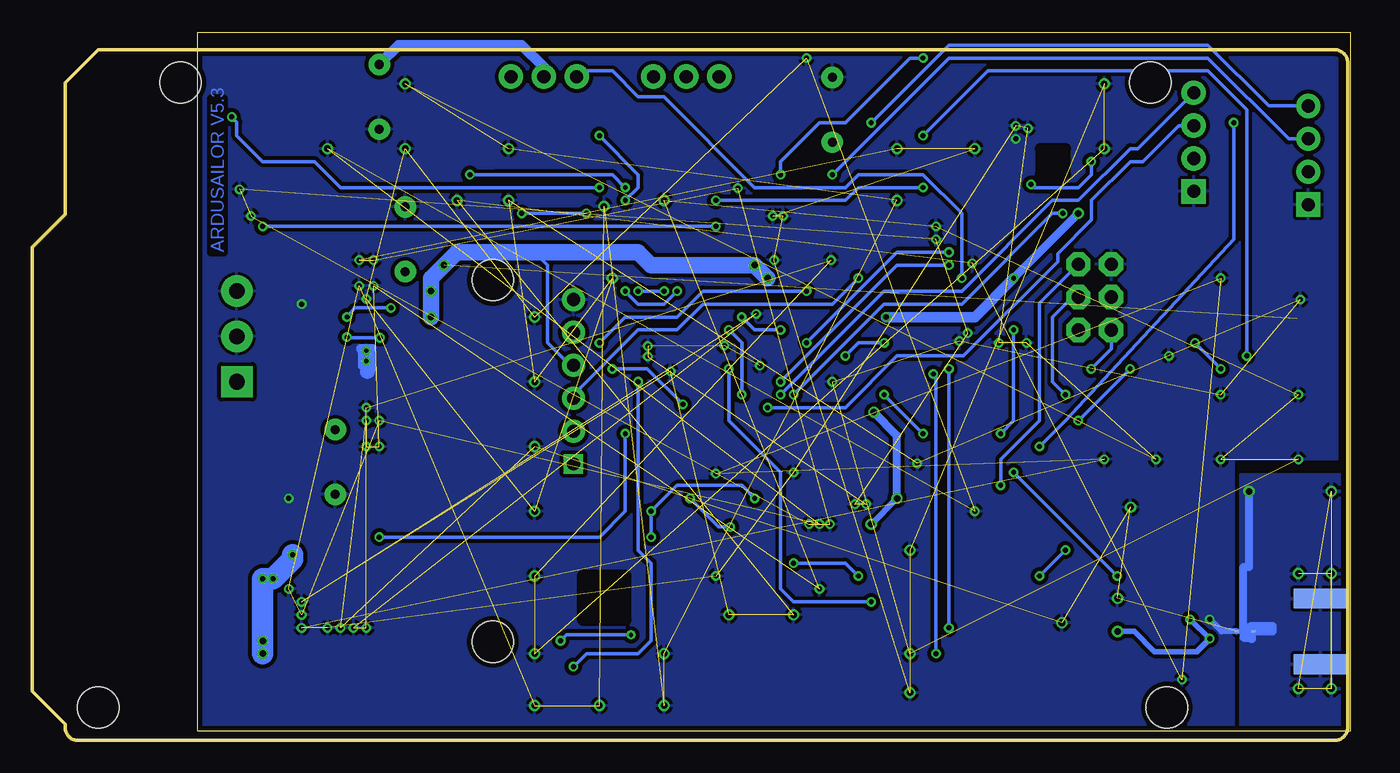
[diagram p3: board, bottom side, seen from below]

Size 101.8 x 54.68 mm. Coordinates in mm from the lower left corner, seen from the top.
Outline: 0,0.7 89.03,0.7 89.03,54.68 0,54.68 0,0.7
Outline: 96.72,53.34 99.26,50.8 99.26,40.64 101.8,38.1 101.8,3.81 99.26,1.27 99.26,1 arc-90 98.26,0 1.2,0 arc-90 0.2,1 0.2,52.34 arc-90 1.2,53.34 96.72,53.34
Copper layers (1*16): Top 0.0356mm / dielectric 1.5011mm / Bottom 0.0356mm
Design rules "oshpark *": minimum track width 0.1523mm, minimum drill 0.3301mm, track to track 0.1523mm, track to pad 0.1523mm, pad to pad 0.1523mm, via to via 0.1523mm, smd to smd 0.1523mm, copper to edge 0.3809mm, drill to drill 0.1523mm, minimum pad ring 7mil, minimum via ring 7mil, stop-mask expansion 3mil, vias tented up to drill 15mil, thermal gap 10mil
Holes 3.2 mm at 96.72,2.54 15.44,50.8 90.37,50.8 14.17,2.54 66.24,35.56 66.24,7.62
tRestrict: area 22,43.7 to 23.9,45.7; area 56.1,9.3 to 58.9,12.1
bRestrict: area 56,9.3 to 59.2,12.7; area 22,43.7 to 23.9,45.7

### Footprints (pad centres in the part's own frame; a part is rotated, then mirrored left to right if it is on the bottom)
0603-CAP = smd 1.1 x 1: 1 -0.85,0; 2 0.85,0
EIA3216 = smd 1.4 x 1.6: A 1.4,0; C -1.4,0
CAP-PTH-5MM = drill 0.7 pad 1.651: 1 -2.5,0; 2 2.5,0
C0603-ROUND = smd 0.898 x 1.1: 1 -0.889,0; 2 0.889,0
1206 = smd 1.6 x 1.8: 1 -1.4,0; 2 1.4,0
0805 = smd 0.8 x 1.2: 1 -0.9,0; 2 0.9,0
DSK-621 = smd 4 x 1.8: GND 0,-5.05 | smd 5 x 2: VCC 0,5.15
0402-CAP = smd 0.7 x 0.9: 1 -0.65,0; 2 0.65,0
1X04 = drill 1.016 pad 1.88 square: 1 0,0 | drill 1.016 pad 1.88: 2 2.54,0; 3 5.08,0; 4 7.62,0
SOD-323 = smd 0.63 x 0.83: 1 -1.15,0; 2 1.15,0
MINIMELF = smd 1.4 x 1.8: A 1.7,0; C -1.7,0
MICROSMP = smd 0.8 x 0.8: A 1.2,0 | smd 2 x 1.1: C -0.7,0
TQFP100 = smd 1.5 x 0.3: 1 -8,6; 2 -8,5.5; 3 -8,5; 4 -8,4.5; 5 -8,4; 6 -8,3.5; 7 -8,3; 8 -8,2.5; 9 -8,2; 10 -8,1.5; 11 -8,1; 12 -8,0.5; 13 -8,0; 14 -8,-0.5; 15 -8,-1; 16 -8,-1.5; 17 -8,-2; 18 -8,-2.5; 19 -8,-3; 20 -8,-3.5; 21 -8,-4; 22 -8,-4.5; 23 -8,-5; 24 -8,-5.5; 25 -8,-6; 51 8,-6; 52 8,-5.5; 53 8,-5; 54 8,-4.5; 55 8,-4; 56 8,-3.5; 57 8,-3; 58 8,-2.5; 59 8,-2; 60 8,-1.5; 61 8,-1; 62 8,-0.5; 63 8,0; 64 8,0.5; 65 8,1; 66 8,1.5; 67 8,2; 68 8,2.5; 69 8,3; 70 8,3.5; 71 8,4; 72 8,4.5; 73 8,5; 74 8,5.5; 75 8,6 | smd 0.3 x 1.5: 26 -6,-8; 27 -5.5,-8; 28 -5,-8; 29 -4.5,-8; 30 -4,-8; 31 -3.5,-8; 32 -3,-8; 33 -2.5,-8; 34 -2,-8; 35 -1.5,-8; 36 -1,-8; 37 -0.5,-8; 38 0,-8; 39 0.5,-8; 40 1,-8; 41 1.5,-8; 42 2,-8; 43 2.5,-8; 44 3,-8; 45 3.5,-8; 46 4,-8; 47 4.5,-8; 48 5,-8; 49 5.5,-8; 50 6,-8; 76 6,8; 77 5.5,8; 78 5,8; 79 4.5,8; 80 4,8; 81 3.5,8; 82 3,8; 83 2.5,8; 84 2,8; 85 1.5,8; 86 1,8; 87 0.5,8; 88 0,8; 89 -0.5,8; 90 -1,8; 91 -1.5,8; 92 -2,8; 93 -2.5,8; 94 -3,8; 95 -3.5,8; 96 -4,8; 97 -4.5,8; 98 -5,8; 99 -5.5,8; 100 -6,8
2X3 = drill 1.016 pad 1.88 octagon: 1 0,0; 2 0,2.54; 3 2.54,0; 4 2.54,2.54; 5 5.08,0; 6 5.08,2.54
SCREWTERMINAL-3.5MM-3 = drill 1.2 pad 2.413 square: 1 0,0 | drill 1.2 pad 2.413: 2 3.5,0; 3 7,0
FTDI_DEVICE_SIDE = drill 1 square: P$1 -6.35,0 | drill 1.016 pad 1.778: P$2 -3.81,0; P$3 -1.27,0; P$4 1.27,0; P$5 3.81,0; P$6 6.35,0
SMA-EDGE = smd 1.524 x 4.064: GND@0 0,0; GND@1 5.08,0; SIG 2.54,0 | smd 1.524 x 4.064 bottom: GND@2 0,0; GND@3 5.08,0
0603 = smd 1.1 x 1: 1 -0.85,0; 2 0.85,0
VLCF4020 = smd 1.27 x 0.635: P$1 0,1.27; P$2 0,-1.27
SLF7055 = smd 1.5 x 2.2: P$1 -3.15,0; P$2 3.15,0
SOT23 = smd 1 x 1.4: 1 -0.95,-1.1; 2 0.95,-1.1; 3 0,1.1
SOT23-3 = smd 0.8 x 0.9: 1 -0.95,-1; 2 0.95,-1; 3 0,1.1
0603-RES = smd 1.1 x 1: 1 -0.85,0; 2 0.85,0
GND-JUMP = smd 0.305 x 0.152: 1 -0.635,0; 2 0.635,0
R0603-ROUND = smd 0.898 x 1.1: 1 -0.889,0; 2 0.889,0
CAT16 = smd 0.5 x 0.65: 1 -1.2,-0.675; 2 -0.4,-0.675; 3 0.4,-0.675; 4 1.2,-0.675; 5 1.2,0.675; 6 0.4,0.675; 7 -0.4,0.675; 8 -1.2,0.675
1X03 = drill 1.016 pad 1.88: 1 0,0; 2 2.54,0; 3 5.08,0
LED-0603 = smd 0.8 x 0.8: A 0,-0.75; C 0,0.75
QFN-24-NP = smd 0.8 x 0.3: 1 -2,1.25; 2 -2,0.75; 3 -2,0.25; 4 -2,-0.25; 5 -2,-0.75; 6 -2,-1.25; 13 2,-1.25; 14 2,-0.75; 15 2,-0.25; 16 2,0.25; 17 2,0.75; 18 2,1.25 | smd 0.3 x 0.8: 7 -1.25,-2; 8 -0.75,-2; 9 -0.25,-2; 10 0.25,-2; 11 0.75,-2; 12 1.25,-2; 19 1.25,2; 20 0.75,2; 21 0.25,2; 22 -0.25,2; 23 -0.75,2; 24 -1.25,2
VENUS638FLPX = smd 1 x 0.36: 1 -4.9,4; 2 -4.9,3.2; 3 -4.9,2.4; 4 -4.9,1.6; 5 -4.9,0.8; 6 -4.9,0; 7 -4.9,-0.8; 8 -4.9,-1.6; 9 -4.9,-2.4; 10 -4.9,-3.2; 11 -4.9,-4; 23 4.9,-4; 24 4.9,-3.2; 25 4.9,-2.4; 26 4.9,-1.6; 27 4.9,-0.8; 28 4.9,0; 29 4.9,0.8; 30 4.9,1.6; 31 4.9,2.4; 32 4.9,3.2; 33 4.9,4 | smd 0.36 x 1: 12 -4,-4.9; 13 -3.2,-4.9; 14 -2.4,-4.9; 15 -1.6,-4.9; 16 -0.8,-4.9; 17 0,-4.9; 18 0.8,-4.9; 19 1.6,-4.9; 20 2.4,-4.9; 21 3.2,-4.9; 22 4,-4.9; 34 4,4.9; 35 3.2,4.9; 36 2.4,4.9; 37 1.6,4.9; 38 0.8,4.9; 39 0,4.9; 40 -0.8,4.9; 41 -1.6,4.9; 42 -2.4,4.9; 43 -3.2,4.9; 44 -4,4.9 | smd 0.6 x 0.6: 45 -3,3; 46 -3,1.5; 47 -3,0; 48 -3,-1.5; 49 -3,-3; 50 -1.5,3; 51 -1.5,1.5; 52 -1.5,0; 53 -1.5,-1.5; 54 -1.5,-3; 55 0,3; 56 0,1.5; 57 0,0; 58 0,-1.5; 59 0,-3; 60 1.5,3; 61 1.5,1.5; 62 1.5,0; 63 1.5,-1.5; 64 1.5,-3; 65 3,3; 66 3,1.5; 67 3,0; 68 3,-1.5; 69 3,-3
MICRO-SD-SOCKET-PP = smd 0.8 x 1.5: 1 -8.94,10.7; 2 -7.84,10.3; 3 -6.74,10.7; 4 -5.64,10.9; 5 -4.54,10.7; 6 -3.44,10.9; 7 -2.34,10.7; 8 -1.24,10.7 | smd 1.8 x 1.4: CD1 -2.05,0.4; CD2 -7.75,0.4 | smd 1.4 x 1.9: GND1 -13.6,14.55; GND3 -0.45,13.55
16LPCC = smd 0.65 x 0.28: 1 -1.37,0.75; 2 -1.37,0.25; 3 -1.37,-0.25; 4 -1.37,-0.75; 9 1.37,-0.75; 10 1.37,-0.25; 11 1.37,0.25; 12 1.37,0.75 | smd 0.28 x 0.65: 5 -0.75,-1.37; 6 -0.25,-1.37; 7 0.25,-1.37; 8 0.75,-1.37; 13 0.75,1.37; 14 0.25,1.37; 15 -0.25,1.37; 16 -0.75,1.37
S-PWSON-N8 = smd 0.35 x 0.64: P1 -0.75,-1.06; P2 -0.25,-1.06; P3 0.25,-1.06; P4 0.75,-1.06; P5 0.75,1.05; P6 0.25,1.05; P7 -0.25,1.05; P8 -0.75,1.05 | smd 1.6 x 0.9: P_THERM 0,0 | drill 0.33: P_THERM_VIA -0.4,0; P_THERM_VIA1 0.4,0
SOT23-6 = smd 0.6 x 0.9: 1 -0.95,-1.15; 2 0,-1.15; 3 0.95,-1.15; 4 0.95,1.15; 5 0,1.15; 6 -0.95,1.15
VPAC0 = drill 0.5 pad 0.856: VP 0,0
VPAC1 = drill 0.508 pad 0.864: VP 0,0
VPAC2 = drill 0.381 pad 0.737: VP 0,0
RESONATOR = smd 0.7 x 2: 1 -1,0; 2 0,0; 3 1,0

### Placement (x,y rotation side)
C1  54.2,11.83 90 top
C2  58.1,14.92 90 top
C3  61.63,9.17 0 top
C4  57.91,6.12 270 top
C5  21.93,11.62 90 top
C6  19.88,11.62 270 top
C7  20.49,6.86 90 top
C8  7.48,4.58 90 top
C9  73,38.7 90 top
C10  19.88,17.18 180 top
C11  36.9,41.1 90 top
C12  52.4,30.05 0 top
C13  75,49.7 270 top
C14  31.65,32.55 180 top
C15  34.2,38.95 180 top
C16  37.75,20.3 270 top
C17  84,9.55 180 top
C18  84,21.75 0 top
C19  81.7,16.05 90 top
C20  76,5.7 90 top
C21  77,27.4 180 top
C22  75,32.15 0 top
C23  26.35,33.65 0 top
C24  40,48.7 90 top
C25  24.69,41.71 0 top
C26  21.73,48.26 270 top
C27  24.47,48.89 0 top
C28  46.1,41.1 90 top
C29  62,20.7 270 top
C30  26.7,9.95 0 top
C31  78,5.7 90 top
C32  84,11.3 180 top
C33  79.15,34.1 0 top
C34  78.4,21.5 270 top
CAM45  12.09,42.4 90 top
D1  19.84,20.31 0 top
D4  48,14.7 0 top
D$1  51,47.7 0 top
D$2  62.65,47.7 0 top
IC3  42,30.7 0 top
J1  21,31.7 90 top
JP1  86,27.7 90 top
JP2  60,27.7 90 top
JP5  2.32,10.96 270 top
L1  5.56,4.58 90 top
L2  71.95,28.8 180 top
L3  83.15,4.85 180 top
Q1  86,40.7 180 top
Q2  7,45.7 180 top
Q3  32,11.7 90 top
Q4  16.3,40.8 0 top
Q5  67,48.7 90 top
Q6  56,48.7 90 top
Q7  82,42.7 0 top
Q8  82,46.75 0 top
R1  80,27.7 90 top
R2  7,48.7 0 top
R3  19.27,6.86 90 top
R4  19.88,15.91 180 top
R5  86,47.35 180 top
R6  19.85,18.44 180 top
R7  8.13,8.42 0 bottom
R8  67.48,45.7 180 top
R9  59.33,47.89 90 top
R10  7,50.7 0 top
R11  86,49 0 top
R12  40.35,20.8 180 top
R13  78,15.7 0 top
R14  84,20.2 180 top
R15  84,18.7 0 top
R16  78.65,31.75 90 top
R17  80.7,31.75 270 top
R18  72,24.7 0 top
R19  86,45.7 180 top
R20  8.9,41.3 270 top
R21  35,11.7 270 top
R22  36,8.7 0 top
R23  6.8,41.3 270 top
R24  86,43.7 0 top
R25  53.9,21.9 180 top
R26  66.35,39.7 0 top
R27  82,39.7 180 top
RN1  44,17.7 90 top
S_RUD45  64.83,51.26 180 top
S_WINCH45  53.83,51.26 180 top
STATUS45  54,24.7 270 top
U1  57.51,10.72 0 top
U2  11.62,11.62 180 top
U3  16.13,38.21 90 top
U4  23,44.7 90 top
U$1  76,29.7 90 top
U$2  84,14.7 0 top
U$4  4.38,17.25 0 top
VP_0  70,36.7 0 top
VP_1  17.97,10.98 0 top
VP_2  16.97,18.02 0 top
VP_3  22.27,9.09 0 top
VP_4  63,22.7 0 top
VP_5  78,8.7 0 top
VP_6  76,24.7 0 top
VP_7  76,22.7 0 top
VP_8  75,22.7 0 top
VP_9  75.45,35.1 0 top
VP_10  41,11.7 0 top
VP_11  53,41.7 0 top
VP_12  32,39.7 0 top
VP_13  4,26.7 0 top
VP_14  10,21.7 0 top
VP_15  4,21.7 0 top
VP_16  34,6.7 0 top
VP_17  40,27.7 0 top
VP_18  30.2,30.85 0 top
VP_19  10,26.7 0 top
VP_20  3.85,34.05 0 top
VP_21  14,29.7 0 top
VP_22  33.45,21.4 0 top
VP_23  65,41.7 0 top
VP_24  63,27.7 0 top
VP_25  57,35.7 0 top
VP_26  63,17.7 0 top
VP_27  76,34.1 0 top
VP_28  73,45.7 0 top
VP_29  63,32.7 0 top
VP_30  42,52.7 0 top
VP_31  29,17.7 0 top
VP_32  79,45.7 0 top
VP_33  41,16.7 0 top
VP_34  75,24.7 0 top
VP_35  81,9.7 0 top
VP_36  82,11.7 0 top
VP_37  76.55,35.1 0 top
VP_38  63,2.7 0 top
VP_39  58,2.7 0 top
VP_40  57.65,41.25 0 top
VP_41  53,2.7 0 top
VP_42  53,6.7 0 top
VP_43  35,41.7 0 top
VP_44  65,45.7 0 top
VP_45  73,50.7 0 top
VP_46  15,21.7 0 top
VP_47  25,30.7 0 top
VP_48  27.15,30.7 0 top
VP_49  24.89,47.26 0 top
VP_50  25.84,47.46 0 top
VP_51  43,20.7 0 top
VP_52  49,12.7 0 top
VP_53  79,8.7 0 top
VP_54  81,8.7 0 top
VP_55  19,21.7 0 top
VP_56  49,20.6 0 top
VP_57  10,35.7 0 top
VP_58  13,4.7 0 top
VP_59  29.2,36.85 0 top
VP_60  69,41.7 0 top
VP_61  43,9.7 0 top
VP_62  48,9.7 0 top
VP_63  52.5,28.5 0 top
VP_64  81,10.7 0 top
VP_65  45.9,32.95 0 top
VP_66  77,8.7 0 top
VP_67  76,8.7 0 top
VP_68  76,25.7 0 top
VP_69  40.1,37.1 0 top
VP_70  63,12.7 0 top
VP_71  63,6.7 0 top
VP_72  19,45.7 0 top
VP_73  19,50.7 0 top
VP_74  34,14.7 0 top
VP_75  34,3.7 0 top
VP_76  44.5,37.1 0 top
VP_77  43.8,40.5 0 top
VP_78  44.6,40.5 0 top
VP_79  29,45.7 0 top
VP_80  35,45.7 0 top
VP_81  76.55,37.1 0 top
VP_82  75.45,37.1 0 top
VP_83  47.3,42.65 0 top
VP_84  40.2,16.7 0 top
VP_85  41.8,16.7 0 top
VP_86  84.9,40.5 0 top
VP_87  85.8,42.55 0 top
VP_88  32,38.7 0 top
VP_89  29.55,31.45 0 top
VP_90  38.25,18.25 0 top
VP_91  37.4,18.25 0 top
VP_92  54.25,29.65 0 top
VP_93  54.25,30.45 0 top
VP_94  48.35,30.5 0 top
VP_95  45.6,28.95 0 top
VP_96  4,4 0 top
VP_97  1.46,19.24 0 top
VP_98  1.46,4 0 top
VP_99  1.46,12.89 0 top
VP_100  4,12.89 0 top
WIND45  3.24,41.38 90 top
Y1  40.8,18.4 0 top

### Tracks (layer width: path | path; a pad name or v marks a point on that pad's centre or on a via)
3.3V  (via drill 0.33, 0.38, 0.4, 0.5)  (2 unrouted)
  Top 0.203: L2.P$2 70.62,30.05 69.44,28.62 69.44,25.38 70.12,24.7 R18.1 | 34.9,38.65 C15.1 | 35.97,38.65 IC3.100 | R16.2 78.54,32.7 | U4.2 22.71,43.22 22.71,42.92 23.01,42.61 23.77,42.61 23.77,43.22 U4.4
  Top 0.254: U1.3 55.66,10.96 54.96,10.96 54.65,10.65 54.03,10.65 C1.1 | 56.77,8.93 U1.8 56.76,8.16 56.4,7.8 56,7.8 v55.55,8.15 | 78.55,32.7 78.54,32.7 v77.5,32.7 | C14.1 32.39,32.2 IC3.10 35.35,32.2 v35.85,32.7 | v46,36.7 IC3.80 46.1,38.8 C28.1 | 43.5,34.2 45,35.2 45,32.7 48,29.7 IC3.61 51.16,29.7 C12.1 | v45,35.7 40,35.7 39,36.7 36.7,36.7 36,37.4 IC3.100 35.34,38.7 C15.1 | 42,12.7 42,14.75 43.33,16.07 RN1.8 RN1.7 RN1.6 | C15.1 34.89,38.81 | Q3.2 33.1,12.55 | 35,39.04 C15.1 | v20,28.7 22,28.7 23,29.7 23,32.7 v26,35.7 | 74.05,32.05 73.7,31.7 73.35,31.7 | IC3.31 38.5,24.2 37,25.7 | U4.13 21.05,45.45 | D4.C 46.3,14 | Q2.2 6.05,48.6 R2.1 | U3.4 4.13,32.57 3,33.7 3,35.7 4,36.7 4,38.7 5,39.7 5,42.7 6,43.7 8.9,43.7 | U1.13 60.48,9.47 C3.1 61,8.95 v61,7.7 | C25.1 23.77,41.71 23.77,42.61 24.31,42.61 v24.65,42.95 | 78.54,32.7 78.5,32.7 C33.1
  Top 0.406: 54.65,10.65 54.65,9.05 v55.55,8.15 | U$1.P6 74.05,29.95 | v37,16.7 37,15.7 40,12.7 42,12.7 45,12.7 | C14.1 32.45,32.3 | 45,12.7 46.7,10.99 49.31,10.98 C1.1 | 33.1,12.55 R21.1 | 17.25,39.7 Q4.2 16.35,40.7 11.15,40.7 10,41.85 9.2,41.85 R20.1 8.9,43.7 8.9,44.8 8,45.7 7.05,45.7 Q2.2 | 46.3,14 45,12.7 | v21,40.7 20,41.7 v20,44.7 20.75,45.45 U4.13
  Top 0.61: 72.85,29.95 74.05,29.95 74.05,32.05 C22.1 | v36.8,25.35 36.8,25.45 37,25.7 37,29.7 40,32.7 | v21,40.7 20,39.7 17.25,39.7 | R21.1 v35,18.7
  Top 0.813: v26,35.7 26,37.7 C23.VCC
  Top 1.016: v74.1,33.4 C22.1 | v71,32.7 71,29.27
  Top 1.27: v35.85,32.7 40,32.7 42,32.7 43.5,34.2 v45,35.7 v46,36.7
  Bottom 0.254: v55.55,8.15 60.55,8.15 v61,7.7 | v77.5,32.7 76.9,33.4 v74.1,33.4 | J1.2 18.46,30.24 v20,28.7 | JP2.P$4 60.27,28.97 62,30.7 62,36.7 63,37.7 | v24.65,42.95 24.4,42.7 21,42.7 20,43.7 v20,44.7
  Bottom 0.406: v37,16.7 v35,18.7
  Bottom 0.61: v35,18.7 35,23.55 v36.8,25.35 | v21,40.7 v26,35.7
  Bottom 0.813: v26,35.7 29,32.7 v35.85,32.7
  Bottom 1.27: v71,32.7 v71,34.7 71,35.7 69,37.7 63,37.7 55,37.7 54,36.7 v46,36.7 v45,35.7
  pour Top (no thermals): 69,28.7 69,37.7 74,37.7 74,30.7 73,30.7 73,28.7
5V
  Top 0.254: D$1.C 50.3,48.4 50,48.7 | 68,18.7 70,20.7 83.15,20.7 R14.2 83.1,20.25 C18.1
  Top 0.813: S_WINCH45.2 51.29,50.99
  Bottom 0.813: S_RUD45.2 62.29,51.99 64,53.7 73.5,53.7 C13.1
  pour Top (no thermals): 81.2,2.15 73,2.1 65,10.1 65,37.3 68,34.3 68,19.7 74,13.7 74,6.05 74.25,5.7 81.2,5.7
  pour Top (no thermals): 68,32.7 65,32.7 60,37.7 60,41.7 59,42.7 59,44.7 61,46.7 61,47.7 62,47.7 62,47.1 63,46.1 63,40.7 68,35.7
  pour Top (no thermals): 60,41.55 57.75,43.7 57.3,44.15 50.05,44.15 48.85,45.35 42.35,45.35 42.35,45.05 42,44.7 39,44.7 38,45.7 38,48.7 39,49.7 50,49.7 50,50.4 51,51.4 52,50.65 52,48.95 51.6,48.55 51.1,48.55 51.1,47.25 51.65,46.7 57,46.7 58,45.7 60,45.7
  pour Top (no thermals): 60,45.7 60.45,46.15 60.45,49.6 61.35,50.5 61.45,50.7 61.45,51.15 62,51.7 62.55,51.7 63.3,51.1 63.35,49.35 62.25,48.25 62.25,45.95 62,45.7
5V_EN  (via drill 0.38)
  Top 0.203: 50.14,36.67 IC3.75
  Top 0.254: 50.14,36.67 53.03,36.67 54,35.7 54,33.7 56,31.7 v56,23.7 56.15,23.85 | R13.1 v75,15.7
  Bottom 0.254: v56,23.7 56,17.7 58,15.7 v75,15.7
ANT
  Top 0.254: L1.2 5.56,8.13 5.27,8.42 | JP5.SIG
  Top 0.813: U2.32 5.27,8.42 4.74,8.42
  Top 2.769: 1.46,8.42 JP5.SIG 4.74,8.42
AREF
  Top 0.254: IC3.98 37,40.11 C11.1
BATT_SENS_EN  (via drill 0.38)
  Top 0.254: v51.55,25.95 51.55,26.5 50.85,27.2 IC3.56 | v57,28.7 57,33.7 58,34.7 58,39.7 v59,40.7 | v64,40.7 64.5,40.7 R26.1
  Bottom 0.254: v59,40.7 v64,40.7 | v51.55,25.95 54.3,28.7 v57,28.7
BOOT_SEL
  Top 0.254: U2.9 17.18,14.01 17.49,14.32 17.49,15.11 18.45,16.07 19.02,16.07 R4.2
CAM_EN  (via drill 0.38)
  Top 0.254: v31,36.7 29.85,37.85 29.85,39.4 29.05,40.2 23,40.2 21.5,38.7 8.55,38.7 R23.2 | v44,27.7 48,27.7 49,28.7 IC3.59
  Bottom 0.254: v44,27.7 35,36.7 v31,36.7
CS  (via drill 0.38)
  Top 0.254: U3.2 7.33,30.37 v8,29.7 | v33,46.7 v33,42.7 | v49,41.7 47.5,40.2 IC3.77
  Bottom 0.254: v8,29.7 8,48.7 11,51.7 28,51.7 v33,46.7 | v33,42.7 38,42.7 39,41.7 v49,41.7
DTR
  Top 0.254: C29.1 JP2.P$1
GND  (via drill 0.38)  (190 unrouted)
  Top 0.203: U1.17 60.67,11.47 | U1.18 60.33,11.97 | 22.86,47.79 22.75,47.79
  Top 0.254: U4.11 22.75,47.79 22.75,47.88 | U4.9 23.76,46.6 | 23.76,46.6 23.76,47.11 | 23.76,46.6 23.76,47.11 v25.84,46.46 24.92,47.11 C27.2 | R17.1 81,32.6 v81,33.7 | R15.1 v82,18.7
  Top 0.406: 23.85,46.8 23.85,46 24.25,46 24.25,46.4 24.1,46.4
  Top 0.813: 75.95,28.45 77,28.45 77,28.55 | 60,12.7 60,11.7
  Bottom 0.406: 9.92,8.42 U2.60 v10.86,9.36
  Bottom 0.445: R7.1 9.92,8.42
  Bottom 0.61: 75.6,28.7 75.55,28.7 75.55,30.3 76.45,30.3 76.45,30.2 76.35,30.2 76.35,28.9 75.9,28.9 75.9,29.8
  Bottom 1.016: 76,28.45 75.85,28.45
  pour Bottom (isolate 0.305, rank 6): 1,54.72 89,54.7 89,18.67 88.92,17.67 88.92,0.89 9,0.89 9,21.7 1,21.7
  pour Top (no thermals): 80.45,14 83.3,14 83.3,7.05 75,7.05 75,13.7 80,13.7
  pour Top (no thermals): 75,26.7 75,27.9 75.6,28.5 75.6,29.05 77.25,29.05 77.25,28.2 77,28.2 77,21.7 74,21.7 74,25.7
  pour Top (no thermals): 75.55,29.7 75.55,32.7 75,32.7 75,37.7 77,37.7 77,31.1 76.4,31.1 76.4,30.2 76,30.2 76,29.7
  pour Top (rank 2): 64,38.7 64,0.7 9,0.7 9,21.7 1,21.7 1,54.7 89,54.7 89,38.7
GPS_EN  (via drill 0.38)
  Top 0.254: IC3.60 48.5,29.2 v48,28.7 | R22.2 36.85,10.55 v37,10.7
  Bottom 0.254: v48,28.7 48,24.7 44,20.7 44,11.7 43,10.7 v37,10.7
GPS_PWR  (via drill 0.38, 0.51)
  Top 0.254: 8.11,3.99 9.22,5.09 U2.36 9.21,6.73 9.21,7.39 9.68,7.86 v10.86,7.86 | 5.61,3.99 L1.1 C8.1 | U2.58 11.62,13.19 | C5.1 21.88,10.87 23,11.99 23,18.3 D1.2
  Top 0.305: 21.88,10.87 22.15,10.87 22.25,10.97 | 8.11,3.99 7.48,3.99 C8.1 | R3.2 18.68,7.71 v17.97,8.42
  Top 0.406: v12.38,9.36 12.38,12.36 U2.58 | U2.2 v17.97,8.42 17.97,9.71 18.48,10.22 C6.A 21.38,10.22 C5.1 22.86,11.7 Q3.3
  Bottom 0.406: v12.38,9.36 v10.86,7.86 11.86,6.86 15.11,6.86 16.68,8.42 v17.97,8.42
INT  (via drill 0.38)
  Top 0.254: v60,5.7 60,7.48 U1.12 | IC3.66 54.5,32.2 55,31.7 v55,27.7
  Bottom 0.254: v55,27.7 55,14.7 54,13.7 54,7.7 55,6.7 59,6.7 v60,5.7
MISO  (via drill 0.38)
  Top 0.254: IC3.22 28.5,26.2 27,24.7 v21,24.7 | U3.7 5.6,35.7 6,35.7 13,28.7 v17,28.7 18,28.7 J1.1
  Bottom 0.254: v21,24.7 v17,28.7
MOSI  (via drill 0.38)
  Top 0.254: IC3.21 28,26.7 27,25.7 13,25.7 v10,28.7 7.23,31.47 U3.3 | J1.4 16.54,34.24 13,30.7 v12,30.7
  Bottom 0.254: v12,30.7 v10,28.7
N$1
  Top 0.254: U1.20 58.26,14.11 C2.1
N$2
  Top 0.254: 57.76,7.12 U1.10
  Top 0.406: C4.1 57.76,7.12
N$3
  Top 0.254: 24.38,45.46 U4.8 26.29,45.45 26.81,45.97 26.81,49.27 25.67,50.42 22.04,50.42 21.75,50.15 21.73,50.13 C26.1
N$5
  Top 0.254: D1.1 18.83,20.31 R6.1
N$7
  Top 0.254: R8.2 66.63,47.33 67,47.7 68.05,47.7 Q5.1
N$8
  Top 0.254: Q6.3 54,48.7
  Top 1.27: D$1.A 53,47.7 54,48.7 54,51.09 S_WINCH45.1
N$9
  Top 0.254: Q5.3 65.55,49.15 65,49.7 65,51.09 S_RUD45.1
  Top 1.016: D$2.A 64,47.7
  Top 1.27: 64,47.7 65.2,48.9 65.2,50.89 S_RUD45.1
N$10
  Top 0.254: Q6.1 58.09,48.74 R9.2
N$11  (via drill 0.38, 0.4, 0.5)
  Top 0.813: U$2.2 v84,12.5 v83.2,12.5 | 86,4.7 86,4.4 L3.P$1 | C19.1 v81.7,14.35
  Top 1.676: 86,4.7 v84,6.7 v84,7.7
  Bottom 1.676: v84,6.7 v84,12.5 v83.2,12.5 81.7,14 v81.7,14.35
N$13
  Top 0.254: U4.12 22.25,46.89 C26.2
N$14
  Top 0.254: 74,28.9 74,28.7
  Top 0.305: U$1.P7 74.55,29.45 74,28.9
  Top 0.813: 74,28.7 74,27.7 73.68,27.53 L2.P$1
N$15
  Top 0.254: U$2.5 84,16.7 83,17.7 80,17.7 79,16.7 79,15.7 R13.2
N$16
  Top 0.254: U4.10 23.25,47.36 23.62,47.73 C27.1
N$17  (via drill 0.38)
  Top 0.254: R17.2 79.65,30.9 | 79.65,30.9 R16.1 78.65,31.15 v77.5,31.15 | v74.95,31.1 U$1.P5 | C33.2 79.65,34.1 79.65,30.9
  Bottom 0.254: v77.5,31.15 77.65,31.1 v74.95,31.1
N$18
  Top 0.254: R18.2 74.8,26.65 74.8,28.8 U$1.P8
N$19
  Top 0.254: U$2.4 84.95,18.6 R15.2 R14.1 84.9,20.25 C18.2
N$20
  Top 0.406: Q4.3 16,41.9 16,41.7 15.33,41.7 CAM45.2
N$21
  Top 0.254: Q4.1 15.25,39.7 11,39.7 10.25,40.45 R20.2 7.2,42.15 R23.1
N$22
  Top 0.254: Q3.1 34.9,10.75 R21.2 35,8.85 R22.1
N$23
  Top 0.254: U$1.P3 78.6,29.95 R1.2 80,28.7 81,28.7 83,30.7 83,36.6 Q1.3 85.95,39.65
N$24
  Top 0.254: Q1.1 86.95,43.6 R24.2
N$26
  Top 0.254: Q2.3 3.92,44.6 WIND45.2
N$27
  Top 0.254: STATUS45.C R25.1
N$28
  Top 0.254: Q2.1 7.85,46.8 R2.2 7.85,49 R10.1
N$29
  Top 0.406: R5.2 82.5,47.35 Q8.3
N$30
  Top 0.406: Q7.3 82,44.8 Q8.1 82,46.7 84,46.7 85,45.7 R19.2
N$31
  Top 0.254: R26.2 R27.2 81.15,41.5 Q7.1
N$32
  Top 0.813: U$2.6 83.05,16.3 82.4,16.95 C19.2
NAV  (via drill 0.38)
  Top 0.254: U2.7 17.72,12.42 v18,12.7 | v26,20.7 30,20.7 v33,23.7 | v36,26.7 v36,30.7 | v39,29.7 40,29.7 42,31.7 v44,31.7 | v47,32.7 IC3.78
  Bottom 0.254: v33,23.7 v36,26.7 | v36,30.7 38,30.7 v39,29.7 | v44,31.7 46,31.7 v47,32.7 | v18,12.7 v26,20.7
RESET  (via drill 0.38)
  Top 0.254: 36,19.7 36,14.7 v38,12.7 | IC3.30 38,21.44 C16.1 37.49,21.19 36,19.7 | D4.A v47.9,16.5 RN1.1 44.67,15.38 v43,13.7 | v27,19.7 36,19.7 | C29.2 60.65,18.7 v51,18.7
  Bottom 0.254: v43,13.7 39,13.7 v38,12.7 | v27,19.7 27,21.7 24,24.7 24,33.78 J1.5 | v51,18.7 48.8,16.5 v47.9,16.5
RFGND  (via drill 0.51)  (10 unrouted)
  Top 0.254: U2.61 9.36,9.36 7.86,9.36 | U2.62 9.36,10.86 7.86,10.86
  Bottom 0.61: R7.2 6,8.42 6,8.45 8.25,8.45 8.25,7.95 7.6,7.95 7.6,7.85 7.65,7.85 7.65,8.85 6,8.85 6,8.7 8.25,8.7 8.25,13.4 7.81,13.4 v7.81,19.24
  pour Top: 8.45,0.73 8.45,20.51 0.19,20.51 0.19,0.73
  pour Bottom: 8.45,0.73 8.45,20.51 0.19,20.51 0.19,0.73
RSTN
  Top 0.254: U2.1 16.89,7.62 18.3,6.21 19.07,6.21 R3.1 C7.1
RUD_EN  (via drill 0.38)
  Top 0.254: IC3.74 52.5,36.2 53,35.7 v53,34.7 | v55,34.7 55,41.7 v56,42.7 | R8.1 68.33,44.03 v68,43.7
  Bottom 0.254: v53,34.7 v55,34.7 | v56,42.7 57,43.7 66,43.7 v68,43.7
RUD_V  (via drill 0.38)
  Top 0.254: IC3.23 29,25.7 v27,23.7 | v26,31.7 v30,35.7
  Bottom 0.254: S_RUD45.3 59.56,51.26 59,51.7 57,51.7 55,49.7 53,49.7 46,42.7 39,42.7 38,43.7 33,43.7 30,40.7 v30,35.7 | v27,23.7 26,24.7 v26,31.7
RX_D0  (via drill 0.38)
  Top 0.254: IC3.2 37.5,36.2 v38,35.7
  Bottom 0.254: v38,35.7 40,33.7 50,33.7 52,31.7 55,31.7 60,26.7 JP2.P$3
RXD1  (via drill 0.38)
  Top 0.254: v45,25.7 45.5,25.2 IC3.45
  Bottom 0.254: v45,25.7 39,25.7 35,29.7 29.87,29.7 22.6,36.97 22.6,37.6 20,40.2 20,41.7 17,44.7 16,44.7 13.22,47.48 CAM45.3
RXD2  (via drill 0.38)
  Top 0.254: v31,8.7 31,3.7 30,2.7 18.64,2.7 15.62,5.72 U2.44 | v31,28.7 31,30.65 31.55,31.2 IC3.12
  Bottom 0.254: v31,8.7 v31,28.7
SCK  (via drill 0.38)
  Top 0.254: IC3.20 27.5,27.2 27,26.7 v22,26.7 14,26.7 7.03,33.67 U3.5
  Bottom 0.254: J1.3 21.46,34.24 23,32.7 23,27.7 v22,26.7
SCL  (via drill 0.38)
  Top 0.254: 47.5,18.2 44.5,21.2 IC3.43 44.5,24.2 42,26.7 v42,30.7 | 47.5,18.2 49,16.7 54.55,16.7 56.75,14.5 U1.23 | RN1.2 46.6,17.3 47.5,18.2 | U4.1 22.25,41.65 23.2,40.7 29.2,40.7 30.3,39.6 30.3,38.4 v31,37.7
  Bottom 0.254: v31,37.7 35,37.7 v42,30.7
SDA  (via drill 0.38)
  Top 0.254: U1.24 56.26,13.44 v54,15.7 | v54,17.7 49,17.7 45,21.7 IC3.44 45,24.7 v43,26.7 | RN1.3 45.4,18.1 v46,18.7 | v22.2,40.7 21.63,41.27 U4.16
  Bottom 0.254: v54,15.7 v54,17.7 52,19.7 47,19.7 v46,18.7 | v43,26.7 36,33.7 30,33.7 23,40.7 v22.2,40.7
STATUS_LED
  Top 0.254: IC3.58 51.5,28.2 53,26.7 53,24.95 STATUS45.A
TX_D0  (via drill 0.38)
  Top 0.254: v42,34.7 38,34.7 37,35.7 IC3.3 | v58,30.7 58,25.89 JP2.P$2
  Bottom 0.254: v42,34.7 50,34.7 52,32.7 56,32.7 v58,30.7
TXD1  (via drill 0.38)
  Top 0.254: IC3.46 46,25.7 45,26.7 v44,26.7
  Bottom 0.254: v44,26.7 36,34.7 30,34.7 23,41.7 21,41.7 17,45.7 16.41,45.7 CAM45.4
TXD2  (via drill 0.38)
  Top 0.203: 34.14,30.72 IC3.13
  Top 0.254: U2.42 14.02,5.68 14.75,4.95 15.3,4.95 18.6,1.7 30,1.7 32,3.7 v32,6.7 | IC3.13 33,30.7 32,29.7 32,28.5 v32.2,28.3
  Bottom 0.254: v32,6.7 32,28.1 v32.2,28.3
V_BATT
  Top 0.254: R1.1 80,24.7
  Top 0.305: 77.85,29.4 77.85,29.45 U$1.P2
  Top 0.406: 77.9,29.3 77.85,29.4 | 82,23.7 82,24.7 JP1.1 88,29.7 88,44.7 87,45.7 R19.1 85.85,44.7 84,44.7 Q8.2
  Top 0.61: 77.9,29.3 C21.1 78,27.4
  Top 1.016: 80,24.7 78,24.7 78,27.4
  Top 1.27: 80,24.7 82,24.7
  pour Top (no thermals): 89,29.7 84,29.7 81.8,27.4 78.35,27.4 77.5,27.2 77.5,24.3 79,22.7 86,22.7 86,13.95 85.05,13.9 85.05,7.7 86,6.7 89,6.7
V_BATT_DIV  (via drill 0.38)
  Top 0.203: 42.52,38.8 IC3.87
  Top 0.254: 42.52,38.8 42.52,43.22 43.8,44.5 48.85,44.5 49.85,43.5 57.2,43.5 v58,42.7 | R11.2 86.85,48.6 v86.4,48.15 86.85,47.7 R5.1
  Bottom 0.254: v58,42.7 78,42.7 80,44.7 84,44.7 86,46.7 86,47.75 v86.4,48.15
VBAT  (via drill 0.38)
  Top 0.254: U2.18 10.81,17.16 12.62,18.97 18.47,18.97 R6.2 19.24,18.2 19.5,18.2 20.52,17.18 C10.1 | 20.51,17.19 C10.1 | C10.1 21.52,17.18 22,16.7 v22,14.7 | v24,12.7 24.3,12.7 C30.VCC
  Bottom 0.254: v22,14.7 v24,12.7
VCC_EN  (via drill 0.38)
  Top 0.203: 48.01,38.65 IC3.76
  Top 0.254: 48.01,38.65 IC3.76 v49,39.7 | v84,39.7 84,42.55 R24.1
  Bottom 0.254: v49,39.7 v84,39.7
WINCH_EN  (via drill 0.38)
  Top 0.254: IC3.73 51,35.7 v52,34.7 | v56,34.7 v56,41.7 | R9.1 58.99,46.7 v58,46.7
  Bottom 0.254: v56,41.7 55,42.7 55,43.7 v58,46.7 | v52,34.7 53,33.7 55,33.7 v56,34.7
WIND_EN  (via drill 0.38)
  Top 0.254: IC3.57 49,27.7 48,26.7 v47,26.7 | v48,31.7 48,36.7 50,38.7 50,42.7 49,43.7 v44,43.7 | v33,52.7 9.85,52.7 R10.2
  Bottom 0.254: v47,26.7 47,30.7 v48,31.7 | v33,52.7 34,52.7 39,47.7 41,47.7 44,44.7 v44,43.7
WN_V  (via drill 0.38)
  Top 0.254: IC3.24 29.5,25.2 27,22.7 v24,22.7 | v9,47.7 9,49.7 11,51.7 30,51.7 32,49.7 45,49.7 47,51.7 48.19,51.7 S_WINCH45.3
  Bottom 0.254: v24,22.7 22,24.7 9,38.7 v9,47.7
WS_1  (via drill 0.38)
  Top 0.254: v37,47.7 37,44.7 41.5,40.2 IC3.89
  Bottom 0.254: v37,47.7 31,53.7 11,53.7 6.3,49 WIND45.4
WS_2  (via drill 0.38)
  Top 0.254: v40,43.7 40,42.7 42,40.7 IC3.88
  Bottom 0.254: v40,43.7 31,52.7 11,52.7 4.76,46.46 WIND45.3
XTAL1
  Top 0.254: IC3.34 40,21.7 41,20.7 41.14,20.7 R12.1 41.8,20.24 Y1.3
XTAL2
  Top 0.254: IC3.33 39.46,22.66 R12.2 39.46,18.74 Y1.1

### Text on the board
Bottom: ARDUSAILOR V5.3
tPlace: Y | Z | X
tNames: GND | GND | WS1 | CAM_RX | WS2 | CAM_TX | VCC | VCC | GND | GND | GND | V_BATT
UNCONECTED_WireText: V:GND:31:101 | V:GND:74:101 | V:GND:46:101 | FillOverPAD:GND:223:445 | FillOverPAD:GND:220:445 | FillOverPAD:3.3V:233:445 | FillOverPAD:GND:54:445 | FillOverPAD:GND:251:445 | V:GND:50:101 | V:GND:51:101 | FillOverPAD:5V:74:445 | FillOverPAD:5V:76:445 | FillOverPAD:3.3V:211:445 | TS:GND:4:16::L1 | TE:GND:7:16::L1 | TE:GND:6:16::L1 | TS:GND:7:16::L1 | V:GND:73:101 | FillOverPAD:3.3V:435:445 | FillOverPAD:GND:433:445 | TE:GND:4:16::L1 | TS:GND:5:16::L1 | FillOverPAD:GND:431:445 | TE:GND:5:16::L1 | TS:GND:6:16::L1 | V:GND:80:101 | V:GND:81:101 | V:GND:45:101 | V:GND:29:101 | V:GND:33:101 | FillOverPAD:V_BATT:229:445 | FillOverPAD:V_BATT:267:445 | FillOverPAD:3.3V:424:445 | FillOverPAD:3.3V:426:445 | V:GND:84:101 | V:GND:88:101 | FillOverPAD:3.3V:269:445 | FillOverPAD:3.3V:49:445 | FillOverPAD:GND:50:445 | V:GND:44:101 | FillOverPAD:GND:22:445 | FillOverPAD:GND:56:445 | V:GND:12:101 | V:GND:41:101 | V:GND:24:101 | V:GND:61:101 | FillOverPAD:GND:226:445 | FillOverPAD:GND:208:445 | V:GND:78:101 | V:GND:79:101 | FillOverPAD:3.3V:55:445 | V:GND:87:101 | FillOverPAD:3.3V:217:445 | V:GND:13:101 | FillOverPAD:GND:283:445 | FillOverPAD:3.3V:46:445 | V:GND:89:101 | FillOverPAD:GND:30:445 | FillOverPAD:3.3V:29:445 | FillOverPAD:3.3V:180:445 | FillOverPAD:GND:179:445 | FillOverPAD:GND:161:445 | FillOverPAD:3.3V:160:445 | FillOverPAD:GND:422:445 | V:GND:70:101 | V:GND:77:101 | V:GND:83:101 | V:GND:82:101 | V:GND:60:101 | V:3.3V:1:101 | V:GND:58:101 | FillOverPAD:GND:419:445 | V:GND:26:101 | V:GND:10:101 | V:GND:38:101 | FillOverPAD:GND:416:445 | V:GND:28:101 | V:GND:21:101 | FillOverPAD:3.3V:65:445 | FillOverPAD:3.3V:414:445 | FillOverPAD:GND:28:445 | FillOverPAD:3.3V:27:445 | FillOverPAD:3.3V:90:445 | V:GND:66:101 | V:GND:30:101 | FillOverPAD:3.3V:262:445 | FillOverPAD:GND:263:445 | V:GND:90:101 | FillOverPAD:GND:91:445 | FillOverPAD:3.3V:43:445 | FillOverPAD:GND:44:445 | FillOverPAD:GND:420:445 | V:GND:48:101 | V:GND:49:101 | V:GND:19:101 | V:GND:95:101 | FillOverPAD:GND:142:445 | V:GND:94:101 | TE:GND:10:16::L16 | TS:GND:11:16::L16 | TS:GND:14:16::L16 | TE:GND:11:16::L16 | TS:GND:12:16::L16 | TS:GND:13:16::L16 | V:GND:22:101 | FillOverPAD:3.3V:141:445 | FillOverPAD:3.3V:23:445 | FillOverPAD:GND:24:445 | V:GND:93:101 | FillOverPAD:3.3V:204:445 | FillOverPAD:3.3V:306:445 | TE:GND:16:16::L16 | FillOverPAD:GND:309:445 | TE:GND:13:16::L16 | TE:GND:12:16::L16 | FillOverPAD:V_BATT:302:445 | FillOverPAD:GND:45:445 | V:GND:96:101 | V:GND:64:101 | TE:GND:9:16::L16 | TS:GND:10:16::L16 | TS:GND:9:16::L16 | TE:GND:8:16::L16 | TE:GND:15:16::L16 | TS:GND:16:16::L16 | TS:GND:1:16::L1 | TS:GND:8:16::L16 | TE:GND:14:16::L16 | TS:GND:15:16::L16 | TE:GND:1:16::L1 | TE:GND:2:16::L1 | TS:GND:2:16::L1 | FillOverPAD:GND:301:445 | V:GND:18:101 | V:GND:25:101 | FillOverPAD:GND:42:445 | FillOverPAD:V_BATT:41:445 | V:GND:14:101 | V:GND:20:101 | FillOverPAD:V_BATT:231:445 | V:GND:69:101 | FillOverPAD:GND:421:445 | FillOverPAD:3.3V:265:445 | V:GND:35:101 | V:GND:7:101 | FillOverPAD:3.3V:111:445 | FillOverPAD:GND:112:445 | V:GND:5:101 | V:GND:9:101 | V:GND:8:101 | V:GND:16:101 | V:GND:15:101 | V:GND:47:101 | V:GND:56:101 | V:GND:23:101 | FillOverPAD:GND:280:445 | FillOverPAD:5V:35:445 | V:GND:52:101 | V:GND:57:101 | FillOverPAD:5V:258:445 | V:RFGND:98:101 | FillOverPAD:GND:32:445 | V:GND:92:101 | V:GND:91:101 | FillOverPAD:GND:444:445 | FillOverPAD:GND:259:445 | V:GND:3:101 | FillOverPAD:GND:20:445 | V:GND:32:101 | FillOverPAD:3.3V:290:445 | FillOverPAD:3.3V:291:445 | V:GND:27:101 | FillOverPAD:RFGND:363:445 | FillOverPAD:RFGND:362:445 | FillOverPAD:GND:360:445 | FillOverPAD:GND:356:445 | V:GND:85:101 | V:GND:34:101 | V:GND:86:101 | FillOverPAD:3.3V:292:445 | FillOverPAD:GND:352:445 | FillOverPAD:GND:237:445 | FillOverPAD:GND:4:445 | FillOverPAD:RFGND:365:445 | FillOverPAD:RFGND:410:445 | FillOverPAD:GND:405:445 | FillOverPAD:GND:390:445 | FillOverPAD:GND:351:445 | V:GND:75:101 | FillOverPAD:3.3V:80:445 | FillOverPAD:RFGND:366:445 | FillOverPAD:GND:349:445 | FillOverPAD:GND:312:445 | FillOverPAD:V_BATT:314:445 | V:RFGND:100:101 | V:RFGND:101:101 | FillOverPAD:RFGND:368:445 | FillOverPAD:GND:12:445 | FillOverPAD:GND:10:445 | FillOverPAD:3.3V:214:445 | FillOverPAD:3.3V:271:445 | V:GND:53:101 | FillOverPAD:GND:2:445 | TS:GND:3:16::L1 | V:GND:71:101 | FillOverPAD:RFGND:369:445 | FillOverPAD:RFGND:403:445 | V:GND:11:101 | FillOverPAD:GND:318:445 | FillOverPAD:GND:334:445 | FillOverPAD:GND:335:445 | TE:GND:3:16::L1 | V:GND:37:101 | FillOverPAD:GND:64:445 | FillOverPAD:V_BATT:63:445 | FillOverPAD:RFGND:196:445 | FillOverPAD:RFGND:198:445 | FillOverPAD:RFGND:370:445 | V:GND:2:101 | FillOverPAD:3.3V:1:445 | FillOverPAD:3.3V:320:445 | FillOverPAD:GND:332:445 | V:GND:65:101 | FillOverPAD:RFGND:372:445 | FillOverPAD:RFGND:402:445 | V:GND:4:101 | V:GND:62:101 | V:GND:63:101 | FillOverPAD:3.3V:330:445 | FillOverPAD:3.3V:5:445 | FillOverPAD:GND:6:445 | V:GND:36:101 | FillOverPAD:GND:34:445 | FillOverPAD:V_BATT:33:445 | FillOverPAD:RFGND:244:445 | FillOverPAD:RFGND:406:445 | FillOverPAD:GND:243:445 | FillOverPAD:GND:401:445 | FillOverPAD:3.3V:325:445 | FillOverPAD:GND:326:445 | FillOverPAD:GND:328:445 | V:GND:68:101 | V:GND:67:101 | V:GND:6:101 | V:GND:54:101 | V:GND:55:101 | FillOverPAD:RFGND:374:445 | FillOverPAD:GND:14:445 | V:GND:17:101 | V:GND:43:101 | V:GND:72:101 | FillOverPAD:GND:40:445 | FillOverPAD:GND:62:445 | FillOverPAD:RFGND:197:445 | FillOverPAD:RFGND:199:445 | FillOverPAD:RFGND:16:445 | FillOverPAD:GND:8:445 | V:GND:59:101 | FillOverPAD:GND:59:445 | FillOverPAD:5V:39:445 | FillOverPAD:5V:61:445 | FillOverPAD:5V:206:445 | V:RFGND:99:101 | V:RFGND:97:101 | V:GND:76:101 | V:GND:42:101 | V:GND:40:101 | V:GND:39:101